# EAGLE design Wireless_IMU_v1.0 (EAGLE 9.6.2)
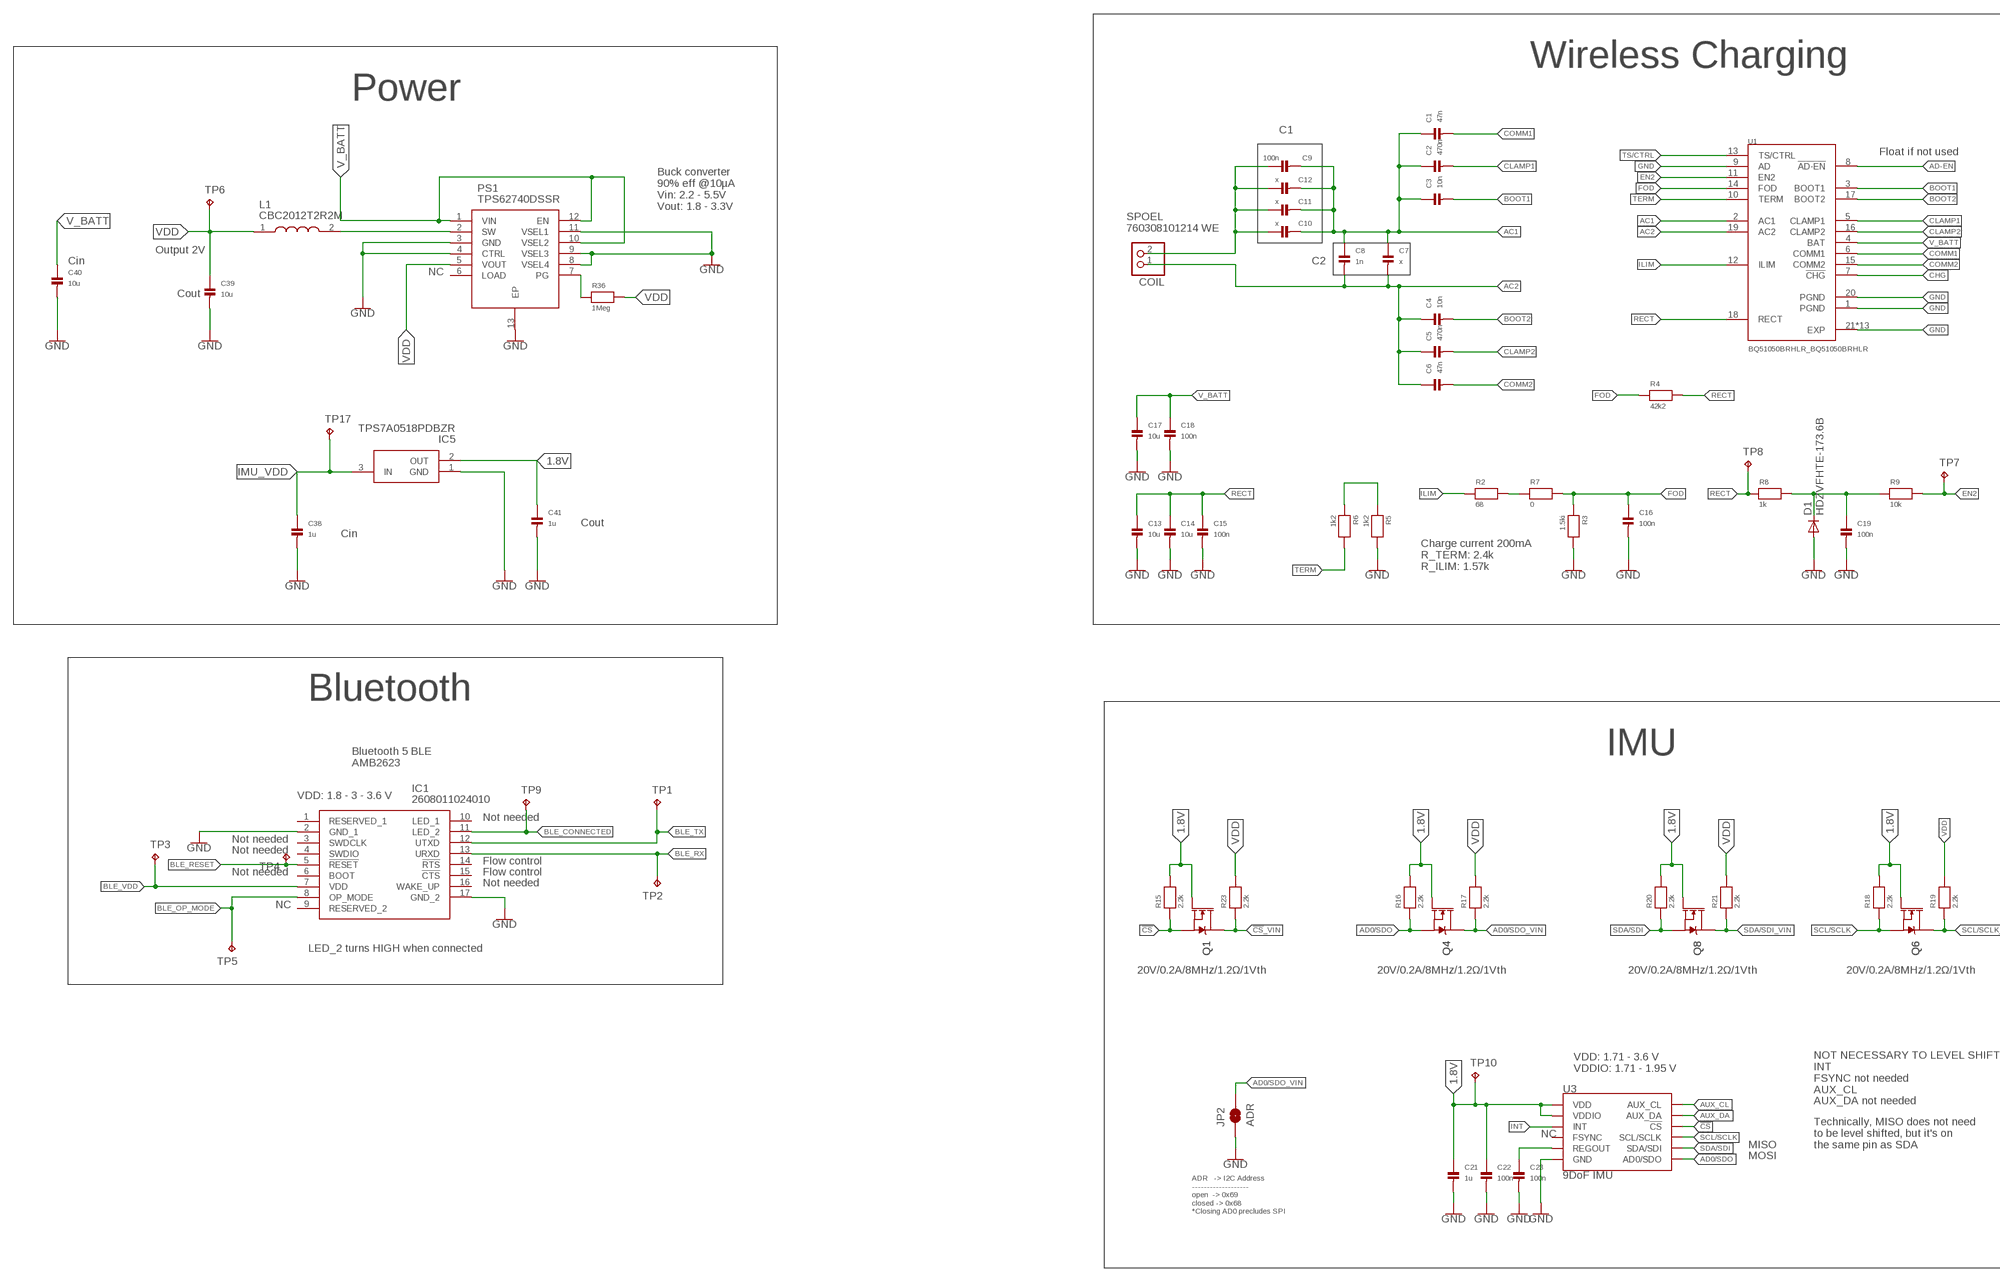
[diagram p0: schematic, sheet 1, part 1 of 2]
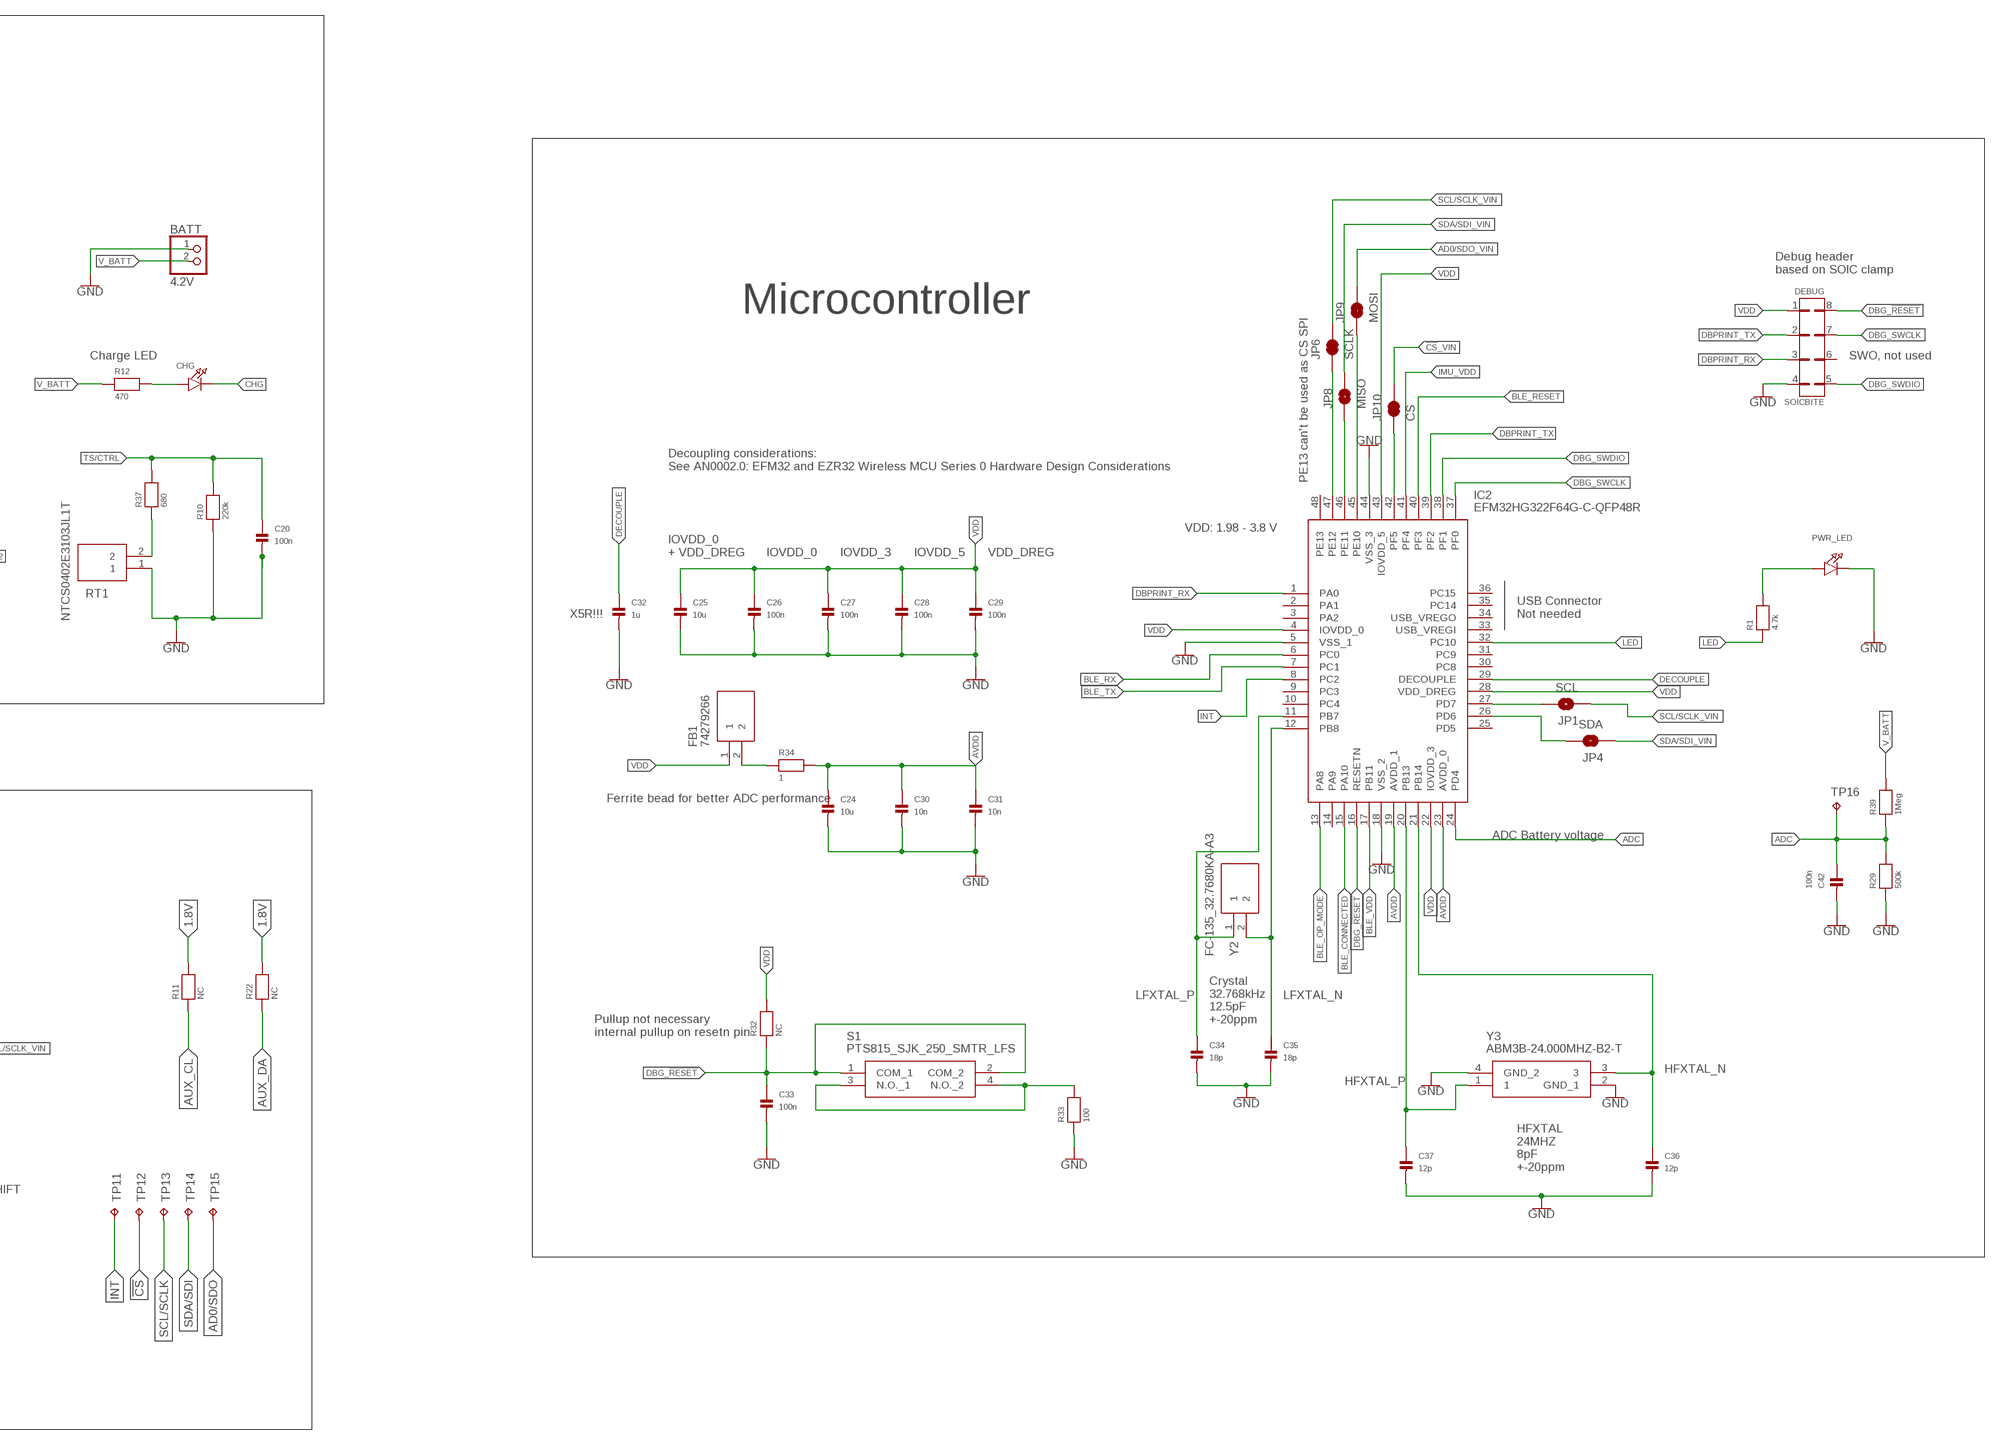
[diagram p1: schematic, sheet 1, part 2 of 2]

## Parts
BATT  4.2V  PINHD-1X2  [1X02]
C1  47n  CAP_CERAMIC0603  [0603]
C2  470n  CAP_CERAMIC0603  [0603]
C3  10n  CAP_CERAMIC0603  [0603]
C4  10n  CAP_CERAMIC0603  [0603]
C5  470n  CAP_CERAMIC0603  [0603]
C6  47n  CAP_CERAMIC0603  [0603]
C7  x  CAP_CERAMIC0603  [0603]
C8  1n  CAP_CERAMIC0603  [0603]
C9  100n  CAP_CERAMIC0603  [0603]
C10  x  CAP_CERAMIC0603  [0603]
C11  x  CAP_CERAMIC0603  [0603]
C12  x  CAP_CERAMIC0603  [0603]
C13  10u  CAP_CERAMIC0603  [0603]
C14  10u  CAP_CERAMIC0603  [0603]
C15  100n  CAP_CERAMIC0603  [0603]
C16  100n  CAP_CERAMIC0603  [0603]
C17  10u  CAP_CERAMIC0603  [0603]
C18  100n  CAP_CERAMIC0603  [0603]
C19  100n  CAP_CERAMIC0603  [0603]
C20  100n  CAP_CERAMIC0603  [0603]
C21  1u  CAP_CERAMIC0603  [0603]
C22  100n  CAP_CERAMIC0603  [0603]
C23  100n  CAP_CERAMIC0603  [0603]
C24  10u  CAP_CERAMIC0603  [0603]
C25  10u  CAP_CERAMIC0603  [0603]
C26  100n  CAP_CERAMIC0603  [0603]
C27  100n  CAP_CERAMIC0603  [0603]
C28  100n  CAP_CERAMIC0603  [0603]
C29  100n  CAP_CERAMIC0603  [0603]
C30  10n  CAP_CERAMIC0603  [0603]
C31  10n  CAP_CERAMIC0603  [0603]
C32  1u  CAP_CERAMIC0603  [0603]
C33  100n  CAP_CERAMIC0603  [0603]
C34  18p  CAP_CERAMIC0603  [0603]
C35  18p  CAP_CERAMIC0603  [0603]
C36  12p  CAP_CERAMIC0603  [0603]
C37  12p  CAP_CERAMIC0603  [0603]
C38  1u  CAP_CERAMIC0603  [0603]
C39  10u  CAP_CERAMIC0603  [0603]
C40  10u  CAP_CERAMIC0603  [0603]
C41  1u  CAP_CERAMIC0603  [0603]
C42  100n  CAP_CERAMIC0603  [0603]
CHG  LED0805  [CHIPLED_0805]
COIL  PINHD-1X2  [1X02]
D1  HDZVFHTE-173.6B  DIODE-SOD323-W  [SOD323-W]
DEBUG  SOICBITE  [SOICBITE]
FB1  74279266  [BEADC1608X100N]
IC1  2608011024010  [2608011024010]
IC2  EFM32HG322F64G-C-QFP48R  [QFP50P900X900X120-48N]
IC5  TPS7A0518PDBZR  [SOT95P237X112-3N]
JP1  SCL  JUMPER-SMT_2_NO_SILK  [SMT-JUMPER_2_NO_SILK]
JP2  ADR  JUMPER-SMT_2_NO_SILK  [SMT-JUMPER_2_NO_SILK]
JP4  SDA  JUMPER-SMT_2_NO_SILK  [SMT-JUMPER_2_NO_SILK]
JP6  SCLK  JUMPER-SMT_2_NC_TRACE_SILK  [SMT-JUMPER_2_NC_TRACE_SILK]
JP8  MISO  JUMPER-SMT_2_NC_TRACE_SILK  [SMT-JUMPER_2_NC_TRACE_SILK]
JP9  MOSI  JUMPER-SMT_2_NC_TRACE_SILK  [SMT-JUMPER_2_NC_TRACE_SILK]
JP10  CS  JUMPER-SMT_2_NC_TRACE_SILK  [SMT-JUMPER_2_NC_TRACE_SILK]
L1  CBC2012T2R2M  [INDC2012X145N]
PS1  TPS62740DSSR  [SON50P200X300X80-13N]
PWR_LED  LED0805  [CHIPLED_0805]
Q1  20V/0.2A/8MHz/1.2Ω/1Vth  MOSFET-NCH-RE1C002UN  [SOT-416FL]
Q4  20V/0.2A/8MHz/1.2Ω/1Vth  MOSFET-NCH-RE1C002UN  [SOT-416FL]
Q6  20V/0.2A/8MHz/1.2Ω/1Vth  MOSFET-NCH-RE1C002UN  [SOT-416FL]
Q8  20V/0.2A/8MHz/1.2Ω/1Vth  MOSFET-NCH-RE1C002UN  [SOT-416FL]
R1  4.7k  RESISTOR0603  [0603]
R2  68  RESISTOR0603  [0603]
R3  1.5ki  RESISTOR0603  [0603]
R4  42k2  RESISTOR0603  [0603]
R5  1k2  RESISTOR0603  [0603]
R6  1k2  RESISTOR0603  [0603]
R7  0  RESISTOR0603  [0603]
R8  1k  RESISTOR0603  [0603]
R9  10k  RESISTOR0603  [0603]
R10  220k  RESISTOR0603  [0603]
R11  NC  RESISTOR0603  [0603]
R12  470  RESISTOR0603  [0603]
R15  2.2k  RESISTOR0603  [0603]
R16  2.2k  RESISTOR0603  [0603]
R17  2.2k  RESISTOR0603  [0603]
R18  2.2k  RESISTOR0603  [0603]
R19  2.2k  RESISTOR0603  [0603]
R20  2.2k  RESISTOR0603  [0603]
R21  2.2k  RESISTOR0603  [0603]
R22  NC  RESISTOR0603  [0603]
R23  2.2k  RESISTOR0603  [0603]
R29  500k  RESISTOR0603  [0603]
R32  NC  RESISTOR0603  [0603]
R33  100  RESISTOR0603  [0603]
R34  1  RESISTOR0603  [0603]
R36  1Meg  RESISTOR0603  [0603]
R37  680  RESISTOR0603  [0603]
R39  1Meg  RESISTOR0603  [0603]
RT1  NTCS0402E3103JL1T  [CAPC1005X65N]
S1  PTS815_SJK_250_SMTR_LFS  [PTS815SJK250SMTRLFS]
TP1  TPTP10R  [TP10R]
TP2  TPTP10R  [TP10R]
TP3  TPTP10R  [TP10R]
TP4  TPTP10R  [TP10R]
TP5  TPTP10R  [TP10R]
TP6  TPTP10R  [TP10R]
TP7  TPTP10R  [TP10R]
TP8  TPTP10R  [TP10R]
TP9  TPTP10R  [TP10R]
TP10  TPTP10R  [TP10R]
TP11  TPTP10R  [TP10R]
TP12  TPTP10R  [TP10R]
TP13  TPTP10R  [TP10R]
TP14  TPTP10R  [TP10R]
TP15  TPTP10R  [TP10R]
TP16  TPTP10R  [TP10R]
TP17  TPTP10R  [TP10R]
U1  BQ51050BRHLR_BQ51050BRHLR  [BQ51050BRHLR_QFN50P450X350X100-21N]
U3  9DoF IMU  SPARKFUN-SENSORS_ICM-20948  [SPARKFUN-SENSORS_QFN24-3X3]
Y2  FC-135_32.7680KA-A3  [FC135327680KAAG0]
Y3  ABM3B-24.000MHZ-B2-T  [ABM3B8000MHZ101UT]

## Nets
1.8V: C21.1 C22.1 C41.1 IC5.2(OUT) Q1.1(G) Q4.1(G) Q6.1(G) Q8.1(G) R11.2 R15.2 R16.2 R18.2 R20.2 R22.2 TP10.TP U3.8(VDDIO) U3.13(VDD)
!CS: Q1.2(S) R15.1 TP12.TP U3.22(!CS)
!CS!_VIN: JP10.2 Q1.3(D) R23.1
AC1: C1.1 C2.1 C3.1 C7.1 C8.1 C9.2 C10.2 C11.2 C12.2 U1.2(AC1)
AC2: C4.1 C5.1 C6.1 C7.2 C8.2 COIL.1 U1.19(AC2)
AC11: C9.1 C10.1 C11.1 C12.1 COIL.2
AD0/SDO: Q4.2(S) R16.1 TP15.TP U3.9(AD0/SDO)
AD0/SDO_VIN: JP2.2 JP9.2 Q4.3(D) R17.1
AD-EN: U1.8(!AD-EN)
ADC: C42.1 IC2.24(PD4) R29.2 R39.1 TP16.TP
AUX_CL: R11.1 U3.7(AUX_CL)
AUX_DA: R22.1 U3.21(AUX_DA)
AVDD: C24.1 C30.1 C31.1 IC2.19(AVDD_1) IC2.23(AVDD_0) R34.2
BLE_CONNECTED: IC1.11(LED_2) IC2.15(PA10) TP9.TP
BLE_OP_MODE: IC1.8(OP_MODE) IC2.13(PA8) TP5.TP
BLE_RESET: IC1.5(!RESET) IC2.40(PF3) TP4.TP
BLE_RX: IC1.13(URXD) IC2.6(PC0) TP2.TP
BLE_TX: IC1.12(UTXD) IC2.7(PC1) TP1.TP
BLE_VDD: IC1.7(VDD) IC2.17(PB11) TP3.TP
BOOT1: C3.2 U1.3(BOOT1)
BOOT2: C4.2 U1.17(BOOT2)
CHG: CHG.C U1.7(!CHG)
CLAMP1: C2.2 U1.5(CLAMP1)
CLAMP2: C5.2 U1.16(CLAMP2)
COMM1: C1.2 U1.6(COMM1)
COMM2: C6.2 U1.15(COMM2)
DBG_!RESET: C33.1 DEBUG.8 IC2.16(RESETN) R32.1 S1.1(COM_1) S1.2(COM_2)
DBG_SWCLK: DEBUG.7 IC2.37(PF0)
DBG_SWDIO: DEBUG.5 IC2.38(PF1)
DBPRINT_RX: DEBUG.3 IC2.1(PA0)
DBPRINT_TX: DEBUG.2 IC2.39(PF2)
DECOUPLE: C32.1 IC2.29(DECOUPLE)
EN2: R9.2 TP7.TP U1.11(EN2)
FOD: C16.1 R3.1 R4.1 R7.2 U1.14(FOD)
GND: BATT.1 C13.2 C14.2 C15.2 C16.2 C17.2 C18.2 C19.2 C20.2 C21.2 C22.2 C23.2 C24.2 C25.2 C26.2 C27.2 C28.2 C29.2 C30.2 C31.2 C32.2 C33.2 C34.2 C35.2 C36.2 C37.2 C38.2 C39.2 C40.2 C41.2 C42.2 D1.A DEBUG.4 IC1.2(GND_1) IC1.17(GND_2) IC2.5(VSS_1) IC2.18(VSS_2) IC2.44(VSS_3) IC5.1(GND) JP2.1 PS1.3(GND) PS1.4(CTRL) PS1.8(VSEL4) PS1.9(VSEL3) PS1.11(VSEL1) PS1.13(EP) PWR_LED.C R3.2 R5.2 R10.1 R29.1 R33.1 RT1.1 U1.1(PGND) U1.9(AD) U1.20(PGND) U1.21(EXP) U1.22(EXP) U1.23(EXP) U1.24(EXP) U1.25(EXP) U1.26(EXP) U1.27(EXP) U1.28(EXP) U1.29(EXP) U1.30(EXP) U1.31(EXP) U1.32(EXP) U1.33(EXP) U3.18(GND) U3.20(GND) Y3.2(GND_1) Y3.4(GND_2)
ILIM: R2.1 U1.12(ILIM)
IMU_VDD: C38.1 IC2.41(PF4) IC5.3(IN) TP17.TP
INT: IC2.8(PC2) TP11.TP U3.12(INT)
LED: IC2.32(PC10) R1.1
N$1: IC2.27(PD7) JP1.2
N$2: R5.1 R6.1
N$3: PWR_LED.A R1.2
N$4: R2.2 R7.1
N$5: CHG.A R12.2
N$6: C19.1 D1.C R8.2 R9.1
N$7: IC2.26(PD6) JP4.2
N$8: IC2.47(PE12) JP6.1
N$9: C35.1 IC2.12(PB8) Y2.2
N$10: C23.1 U3.10(REGOUT)
N$11: IC2.46(PE11) JP8.1
N$12: IC2.45(PE10) JP9.1
N$14: C34.1 IC2.11(PB7) Y2.1
N$15: IC2.42(PF5) JP10.1
N$19: C37.1 IC2.20(PB13) Y3.1
N$20: C36.1 IC2.21(PB14) Y3.3
N$22: R33.2 S1.3(N.O._1) S1.4(N.O._2)
N$24: FB1.2 R34.1
N$25: R37.1 RT1.2
N$28: L1.2 PS1.2(SW)
N$29: PS1.7(PG) R36.1
RECT: C13.1 C14.1 C15.1 R4.2 R8.1 TP8.TP U1.18(RECT)
SCL/SCLK: Q6.2(S) R18.1 TP13.TP U3.23(SCL/SCLK)
SCL/SCLK_VIN: JP1.1 JP6.2 Q6.3(D) R19.1
SDA/SDI: Q8.2(S) R20.1 TP14.TP U3.24(SDA/SDI)
SDA/SDI_VIN: JP4.1 JP8.2 Q8.3(D) R21.1
TERM: R6.2 U1.10(TERM)
TS/CTRL: C20.1 R10.2 R37.2 U1.13(TS/CTRL)
V_BATT: BATT.2 C17.1 C18.1 C40.1 PS1.1(VIN) PS1.10(VSEL2) PS1.12(EN) R12.1 R39.2 U1.4(BAT)
VDD: C25.1 C26.1 C27.1 C28.1 C29.1 C39.1 DEBUG.1 FB1.1 IC2.4(IOVDD_0) IC2.22(IOVDD_3) IC2.28(VDD_DREG) IC2.43(IOVDD_5) L1.1 PS1.5(VOUT) R17.2 R19.2 R21.2 R23.2 R32.2 R36.2 TP6.TP
Unconnected: DEBUG.6 IC1.1(RESERVED_1) IC1.3(SWDCLK) IC1.4(SWDIO) IC1.6(BOOT) IC1.9(RESERVED_2) IC1.10(LED_1) IC1.14(!RTS) IC1.15(!CTS) IC1.16(WAKE_UP) IC2.2(PA1) IC2.3(PA2) IC2.9(PC3) IC2.10(PC4) IC2.14(PA9) IC2.25(PD5) IC2.30(PC8) IC2.31(PC9) IC2.33(USB_VREGI) IC2.34(USB_VREGO) IC2.35(PC14) IC2.36(PC15) IC2.48(PE13) PS1.6(LOAD) U3.11(FSYNC)

## Notes on the sheet
- Wireless Charging
- Power
- C1
- Float if not used
- Buck converter
  90% eff @10µA
  Vin: 2.2 - 5.5V
  Vout: 1.8 - 3.3V
- SPOEL
  760308101214 WE
- Debug header
  based on SOIC clamp
- Output 2V
- Cin | C2
- NC
- Microcontroller
- Cout
- Charge LED | SWO, not used
- Decoupling considerations:
  See AN0002.0: EFM32 and EZR32 Wireless MCU Series 0 Hardware Design Considerations
- PE13 can't be used as CS SPI
- VDD: 1.98 - 3.8 V
- IOVDD_0
  + VDD_DREG
- IOVDD_0 | IOVDD_3 | IOVDD_5 | VDD_DREG
- Cout
- Cin
- X5R!!!
- USB Connector
  Not needed
- Charge current 200mA
  R_TERM: 2.4k
  R_ILIM: 1.57k
- Bluetooth
- Ferrite bead for better ADC performance
- ADC Battery voltage
- IMU
- Bluetooth 5 BLE
  AMB2623
- VDD: 1.8 - 3 - 3.6 V
- Not needed
- Not needed
- Not needed
- Flow control
- Not needed | Flow control
- Not needed | LFXTAL_P | LFXTAL_N
- NC
- Crystal
  32.768kHz
  12.5pF
  +-20ppm
- Pullup not necessary
  internal pullup on resetn pin
- LED_2 turns HIGH when connected | HFXTAL_N
- HFXTAL_P
- HFXTAL
  24MHZ
  8pF
  +-20ppm
- VDD: 1.71 - 3.6 V
  VDDIO: 1.71 - 1.95 V
- NOT NECESSARY TO LEVEL SHIFT
  INT
  FSYNC not needed
  AUX_CL
  AUX_DA not needed
- NC
- MISO
- Technically, MISO does not need 
  to be level shifted, but it's on 
  the same pin as SDA
- MOSI
- ADR   -> I2C Address
  -------------------
  open  -> 0x69
  closed -> 0x68
  *Closing AD0 precludes SPI

## Library data of the parts
BATT COIL = pinhead:PINHD-1X2: PIN HEADER
C1-C42 = microbuilder:CAP_CERAMIC: Ceramic Capacitors 0402 - 0402 Surface Mount Capacitors 16pF 50V 5% [Digikey: 445-4899-2-ND] 18pF 50V 5% [Digikey: 490-1281-2-ND] 22pF 50V 5% [Digikey: 490-1283-2-ND] 68pF 50V 5% [Digikey: 490-1289-2-ND] 0.1uF 10V 10% [Digikey: 490-1318-2-ND] 1.0uF 6.3V 10% [Digikey: 490-1320-2-ND] 0603 - 0603 Surface Mount Capacitors 16 pF 50V 5% [Digikey: 445-5051-2-ND] 22 pF 50V [Digikey: PCC220ACVTR-ND] 33 pF 50V 5% [Digikey: 490-1415-1-ND] 56pF 50V 5% [Digikey: 490-1421-1-ND] 220pF 50V 5% [Digikey: 445-1285-1-ND] 680 pF 50V 2200 pF 50V 5% C0G [Digikey: 445-1297-1-ND] 5600 pF 100V 5% X7R [Digikey: 478-3711-1-ND] 0.1 µF 25V 10% [Digikey: PCC2277TR-ND] 0.22 µF 16V 10% X7R [Digikey: 445-1318-1-ND] 1.0 µF 25V 10% [Digikey: 445-5146-2-ND] 0603 - RF Specific 3pF 250V +/-0.1pF RF [Digikey: 712-1347-1-ND] 18 pF 250V 5% [Digikey: 478-3505-1-ND or 712-1322-1-ND] 56 pF 250V 5% C0G RF [Digikey: 490-4867-1-ND] 68 pF 250V RF [Digikey: 490-4868-1-ND] 0805 - 0805 Surface Mount Capacitors 220 pF 250V 2% RF Ceramic Capacitor [Digikey: 712-1398-1-ND] 1000 pF 50V 2% NP0 Ceramic Capacitor [Digikey: 478-3760-1-ND] 0.1 µF 25V 10% Ceramic Capacitor [Digikey: PCC1828TR-ND] 1.0 µF 16V 10% Ceramic Capacitor[Digikey: 490-1691-2-ND] 10.0 µF 10V 10% Ceramic Capacitor[Digikey: 709-1228-1-ND] 10.0 uF 16V 10% Ceramic Capacitor [Digikey: 478-5165-2-ND] 47 uF 6.3V 20% Ceramic Capacitor [Digikey: 587-1779-1-ND or 399-5506-1-ND] 1206 - 1206 Surface Mount Capacitors 47uF 10V 20% Ceramic Capacitor [Digikey: 490-5528-1-ND or 399-5508-1-ND or 445-6010-1-ND] 100uF 6.3V -20%, +80% Y5V Ceramic Capacitor (Digikey: 490-4512-1-ND, Mouser: 81-GRM31CF50J107ZE1L)
CHG PWR_LED = microbuilder:LED: LED 0603 - 0603 Surface Mount Package 2mA: Green LED - Low Power (3.9mcd, 2ma, 1.7Vf) - Digikey: 475-2709-2-ND Orange LED - Low Power (9.8mcd, 2ma, 1.8Vf) - Digikey: 475-1194-2-ND Red LED - Low Power (5mcd, 2ma, 1.8Vf) - Digikey: 475-1195-2-ND Yellow LED - Low Power (7mcd, 2ma, 1.8Vf) - Digikey: 475-1196-2-ND 5mA: Blue LED - Low Power (17mcd, 5ma, 2.9Vf) - Digikey: LNJ937W8CRACT-ND 0805 - 0805 Surface Mount Package 2mA: Red LED (8.8mcd, 2mA, 1.8Vf, Clear) - Low Power [Digikey: 475-2510-1-ND] Green LED (5mcd, 2mA, 1.8Vf, Clear) - Low Power [Digikey: 475-2730-1-ND] Yellow LED (11.3mcd, 2mA, 1.8Vf, Clear) - Low Power [Digikey: 475-2555-1-ND] 20mA: Red LED (104mcd, 20mA, Diffused) - LS R976 [Digikey: 475-1278-6-ND] Red LED (12mcd, 20mA, 2.0Vf, Clear) - APT2012EC [Digikey: 754-1128-1-ND] Green LED (15mcd, 20mA, 2.2Vf, Clear) - APT2012GC [Digikey: 754-1131-1-ND] Orange LED (160mcd, 20mA, 2.1Vf, Clear) - APT2012SECK [Digikey: 754-1130-1-ND] 1206 - 1206 Surface Mount Package Green LED (26mcd, 20mA, Diffused) - LG N971 [Digikey: 475-1407-6-ND] Red LED (15mcd, 20mA, Diffused) - LH N974 [Digikey: 475-1416-6-ND]
D1 = diode:DIODE-: DIODE
DEBUG = SOICbite_Eagle:SOICBITE: SOICbite footprint Allows for direct clipping of a SOIC-8 Testclip onto a PCB edge for Programming/Debugging purposes without extra components. Original footprint created by: Simon Merrit Adapted to Eagle by: Chiel Voswijk (Foxhood) NOTE: Footprint is to be used on the edge of a PCB and may require the use of thin traces for accessing the inner pads. This may violate some Design Rules! One can often ignore these, but understand working is NOT guaranteed.
FB1 = SamacSys_Parts:74279266: WE-CBF Ferrite Bead 0603 1000Ohm 200mA Wurth WE-CBF Series +/-25% Ferrite Multilayer SMD Inductor, 0603 Case, 200mA dc 600m Rdc Source: Datasheet <https://componentsearchengine.com/Datasheets/1/74279266.pdf>; DESCRIPTION: WE-CBF Ferrite Bead 0603 1000Ohm 200mA Wurth WE-CBF Series +/-25% Ferrite Multilayer SMD Inductor, 0603 Case, 200mA dc 600m Rdc; HEIGHT: 1mm; MANUFACTURER_NAME: Wurth Elektronik; MANUFACTURER_PART_NUMBER: 74279266; MOUSER_PART_NUMBER: 710-74279266; MOUSER_PRICE-STOCK: https://www.mouser.com/Search/Refine.aspx?Keyword=710-74279266
IC1 = SamacSys_Parts:2608011024010: Bluetooth Modules (802.15.1) Proteus-II Series BLE5 Source: Datasheet <https://componentsearchengine.com/Datasheets/1/2608011024010.pdf>; DESCRIPTION: Bluetooth Modules (802.15.1) Proteus-II Series BLE5; HEIGHT: 2.2mm; MANUFACTURER_NAME: Wurth Elektronik; MANUFACTURER_PART_NUMBER: 2608011024010; MOUSER_PART_NUMBER: 710-2608011024010; MOUSER_PRICE-STOCK: https://www.mouser.com/Search/Refine.aspx?Keyword=710-2608011024010
IC2 = SamacSys_Parts:EFM32HG322F64G-C-QFP48R: ARM Microcontrollers - MCU ARM Cortex -M0+ Happy Gecko Microcontroller IC 32-Bit 25MHz 64KB Flash QFN48 (7x7) Source: Datasheet <https://componentsearchengine.com/Datasheets/1/EFM32HG322F64G-C-QFP48R.pdf>; DESCRIPTION: ARM Microcontrollers - MCU ARM Cortex -M0+ Happy Gecko Microcontroller IC 32-Bit 25MHz 64KB Flash QFN48 (7x7); HEIGHT: 1.2mm; MANUFACTURER_NAME: Silicon Labs; MANUFACTURER_PART_NUMBER: EFM32HG322F64G-C-QFP48R; MOUSER_PART_NUMBER: 634-HG322F64GCQFP48R; MOUSER_PRICE-STOCK: https://www.mouser.com/Search/Refine.aspx?Keyword=634-HG322F64GCQFP48R
IC5 = SamacSys_Parts:TPS7A0518PDBZR: 1-A, ultra-low-IQ, 200-mA low-dropout (LDO) regulator in a small-sized package Source: Datasheet <https://www.ti.com/lit/gpn/TPS7A05>; DESCRIPTION: 1-A, ultra-low-IQ, 200-mA low-dropout (LDO) regulator in a small-sized package; HEIGHT: 1.12mm; MANUFACTURER_NAME: Texas Instruments; MANUFACTURER_PART_NUMBER: TPS7A0518PDBZR; MOUSER_PART_NUMBER: 595-TPS7A0518PDBZR; MOUSER_PRICE-STOCK: https://www.mouser.com/Search/Refine.aspx?Keyword=595-TPS7A0518PDBZR
JP1 JP2 JP4 = SparkFun-Jumpers:JUMPER-SMT_2_NO: Normally open jumper This jumper has two pads in close proximity to each other. Apply solder to close the connection. Round pads are easier to solder for beginners, but are a lot larger. SparkFun Product that uses the round pads: SparkFun EL Sequencer <https://www.sparkfun.com/products/12781>
JP6 JP8-JP10 = SparkFun-Jumpers:JUMPER-SMT_2_NC_TRACE: Normally closed trace jumper This jumper has a trace between two pads so it's normally closed (NC). Use a razor knife to open the connection. For best results follow the IPC guidelines for cutting traces: Cutout at least 0.063 mm (0.005 in). Remove all loose material to clean up the cut area. Seal the cut with an approved epoxy. Reapply solder to reclose the connection.
L1 = SamacSys_Parts:CBC2012T2R2M: Taiyo Yuden Type 0805 Wire-wound SMD Inductor 2.2 H +/-20% Wire-Wound 640mA Idc Source: Datasheet <https://componentsearchengine.com/Datasheets/1/CBC2012T2R2M.pdf>; DESCRIPTION: Taiyo Yuden Type 0805 Wire-wound SMD Inductor 2.2 H +/-20% Wire-Wound 640mA Idc; HEIGHT: 1.45mm; MANUFACTURER_NAME: TAIYO YUDEN; MANUFACTURER_PART_NUMBER: CBC2012T2R2M; MOUSER_PART_NUMBER: 963-CBC2012T2R2M; MOUSER_PRICE-STOCK: https://www.mouser.com/Search/Refine.aspx?Keyword=963-CBC2012T2R2M
PS1 = SamacSys_Parts:TPS62740DSSR: 2.2V-5.5V input, ultra-low-power 300mA step-down buck DCDC converter with 360nA Iq Source: Datasheet <http://www.ti.com/lit/gpn/tps62740>; DESCRIPTION: 2.2V-5.5V input, ultra-low-power 300mA step-down buck DCDC converter with 360nA Iq; HEIGHT: 0.8mm; MANUFACTURER_NAME: Texas Instruments; MANUFACTURER_PART_NUMBER: TPS62740DSSR; MOUSER_PART_NUMBER: 595-TPS62740DSSR; MOUSER_PRICE-STOCK: https://www.mouser.com/Search/Refine.aspx?Keyword=595-TPS62740DSSR
Q1 Q4 Q6 Q8 = SparkFun-DiscreteSemi:MOSFET-NCH: N-channel MOSFETs Voltage controlled devices that allow control of high current outputs. SparkFun Products: SparkFun OpenScale <https://www.sparkfun.com/products/13261> SparkFun Digital Sandbox <https://www.sparkfun.com/products/12651> SparkFun Monster Moto Shield <https://www.sparkfun.com/products/10182> SparkFun MOSFET Power Controller <https://www.sparkfun.com/products/11214>; PROD_ID: TRANS_14399
R1-R12 R15-R23 R29 R32-R34 R36 R37 R39 = microbuilder:RESISTOR: Resistors 0402 - 0402 Surface Mount Package 22 Ohm 1% 1/16W [Digikey: 311-22.0LRTR-ND] 33 Ohm 5% 1/16W 1.0K 5% 1/16W 1.5K 5% 1/16W 2.0K 1% 1/16W 10.0K 1% 1/16W [Digikey: 311-10.0KLRTR-ND] 10.0K 5% 1/16W [Digikey: RMCF0402JT10K0TR-ND] 12.1K 1% 1/16W [Digikey: 311-22.0LRTR-ND] 100.0K 5% 1/16W 0603 - 0603 Surface Mount Package 0 Ohm 1/10 Watt 1% Resistor 15 Ohm 1/10 Watt 1% Resistor 33 Ohm 1/10 Watt 1% Resistor 49.9 Ohm 1/10 Watt 1% Resistor 100 Ohm 1/10 Watt 1% Resistor 150 Ohm 1/10 Watt 1% Resistor 240 Ohm 1/10 Watt 1% Resistor 390 Ohm 1/10 Watt 1% Resistor 560 Ohm 1/10 Watt 1% Resistor 680 Ohm 1/10 Watt 1% Resistor 750 Ohm 1/10 Watt 1% Resistor 1.0K Ohm 1/10 Watt 1% Resistor 1.5K Ohm 1/10 Watt 1% Resistor 2.0K Ohm 1/10 Watt 1% Resistor 2.2K Ohm 1/10 Watt 1% Resistor 3.3K Ohm 1/10 Watt 1% Resistor 4.7K Ohm 1/10 Watt 1% Resistor 10.0K Ohm 1/10 Watt 1% Resistor 12.0K Ohm 1/10 Watt 1% Resistor 12.1K Ohm 1/10 Watt 1% Resistor 20.0K Ohm 1/10 Watt 1% Resistor 33.0K Ohm 1/10 Watt 1% Resistor 100.0K Ohm 1/10 Watt 1% Resistor 0805 - 0805 Surface Mount Package 0 Ohm 1/8 Watt 1% Resistor 33 Ohm 1/8 Watt 1% Resistor 100 Ohm 1/8 Watt 1% Resistor 150 Ohm 1/8 Watt 1% Resistor 200 Ohm 1/8 Watt 1% Resistor 240 Ohm 1/8 Watt 1% Resistor 330 Ohm 1/8 Watt 1% Resistor 390 Ohm 1/8 Watt 1% Resistor 470 Ohm 1/8 Watt 1% Resistor 1.0K Ohm 1/8 Watt 1% Resistor 1.5K Ohm 1/8 Watt 1% Resistor 2.0K Ohm 1/8 Watt 1% Resistor 4.7K Ohm 1/8 Watt 1% Resistor 5.1K Ohm 1/8 Watt 1% Resistor 5.6K Ohm 1/8 Watt 1% Resistor 10.0K Ohm 1/8 Watt 1% Resistor 22.0K Ohm 1/8 Watt 1% Resistor 33.0K Ohm 1/8 Watt 1% Resistor 100K Ohm 1/8 Watt 1% Resistor 1206 - 1206 Surface Mount Package 2012 - 2010 Surface Mount Package 0.11 Ohm 1/2 Watt 1% Resistor - Digikey: RHM.11UCT-ND
RT1 = SamacSys_Parts:NTCS0402E3103JL1T: NTC Thermistors 10K 5% 3490K Low B AUTO GRADE Source: Datasheet <https://componentsearchengine.com/Datasheets/1/NTCS0402E3103JL1T.pdf>; DESCRIPTION: NTC Thermistors 10K 5% 3490K Low B AUTO GRADE; HEIGHT: 0.65mm; MANUFACTURER_NAME: Vishay; MANUFACTURER_PART_NUMBER: NTCS0402E3103JL1T; MOUSER_PART_NUMBER: 594-NTCS402E3103JL1T; MOUSER_PRICE-STOCK: https://www.mouser.com/Search/Refine.aspx?Keyword=594-NTCS402E3103JL1T
S1 = SamacSys_Parts:PTS815_SJK_250_SMTR_LFS: Tactile Switches Tact Switch, 12 VDC, 50 mA, 4.2x3.2, 2.5mm H, 250gf, J leads Source: Datasheet <https://componentsearchengine.com/Datasheets/1/PTS815 SJK 250 SMTR LFS.pdf>; DESCRIPTION: Tactile Switches Tact Switch, 12 VDC, 50 mA, 4.2x3.2, 2.5mm H, 250gf, J leads; HEIGHT: 2mm; MANUFACTURER_NAME: C & K COMPONENTS; MANUFACTURER_PART_NUMBER: PTS815 SJK 250 SMTR LFS; MOUSER_PART_NUMBER: 611-PTS815SJK250SMTR; MOUSER_PRICE-STOCK: https://www.mouser.com/Search/Refine.aspx?Keyword=611-PTS815SJK250SMTR
TP1-TP17 = testpad:TP: Test pad
U1 = Wireless_IMU_v1.0:BQ51050BRHLR_BQ51050BRHLR: Qi (WPC) Compliant Highly Integrated Secondary-Side Direct Lithium Ion Charger. 20-VQFN; AVAILABILITY: Unavailable; DESCRIPTION: Qi _WPC_ Compliant Highly Integrated Secondary-Side Direct Lithium Ion Charger. 20-VQFN; MF: Texas Instruments; MP: BQ51050BRHLR; PACKAGE: VQFN-20 Texas Instruments; PRICE: None
U3 = Wireless_IMU_v1.0:SPARKFUN-SENSORS_ICM-20948: ICM-20948 9 Degree of Freedom IMU World’s lowest power 9-axis MotionTracking device that is ideally suited for smartphones, tablets, wearable sensors, and IoT applications. Includes onboard Digital Motion Processor to offload computations from the host processor Datasheet <https://cdn.sparkfun.com/assets/learn_tutorials/5/5/0/MPU9250REV1.0.pdf> SparkFun Products: SparkFun IMU Breakout - ICM-20948 <https://www.sparkfun.com/products/15182>; PROD_ID: IC-14247
Y2 = SamacSys_Parts:FC-135_32.7680KA-A3: Crystals 32.768KHz 20ppm 12.5pF -40C -85C Source: Datasheet <https://componentsearchengine.com/Datasheets/1/FC-135 32.7680KA-A3.pdf>; DESCRIPTION: Crystals 32.768KHz 20ppm 12.5pF -40C -85C; HEIGHT: 0mm; MANUFACTURER_NAME: Epson Timing; MANUFACTURER_PART_NUMBER: FC-135 32.7680KA-A3; MOUSER_PART_NUMBER: 732-FC135-32.76KAA3; MOUSER_PRICE-STOCK: https://www.mouser.com/Search/Refine.aspx?Keyword=732-FC135-32.76KAA3
Y3 = SamacSys_Parts:ABM3B-24.000MHZ-B2-T: Abracon 24MHz Crystal +/-20ppm SMD 5 x 3 x 1.1mm Source: Datasheet <https://componentsearchengine.com/Datasheets/1/ABM3B-24.000MHZ-B2-T.pdf>; DESCRIPTION: Abracon 24MHz Crystal +/-20ppm SMD 5 x 3 x 1.1mm; HEIGHT: 1.1mm; MANUFACTURER_NAME: ABRACON; MANUFACTURER_PART_NUMBER: ABM3B-24.000MHZ-B2-T; MOUSER_PART_NUMBER: 815-ABM3B-24-B2; MOUSER_PRICE-STOCK: https://www.mouser.com/Search/Refine.aspx?Keyword=815-ABM3B-24-B2

## Board
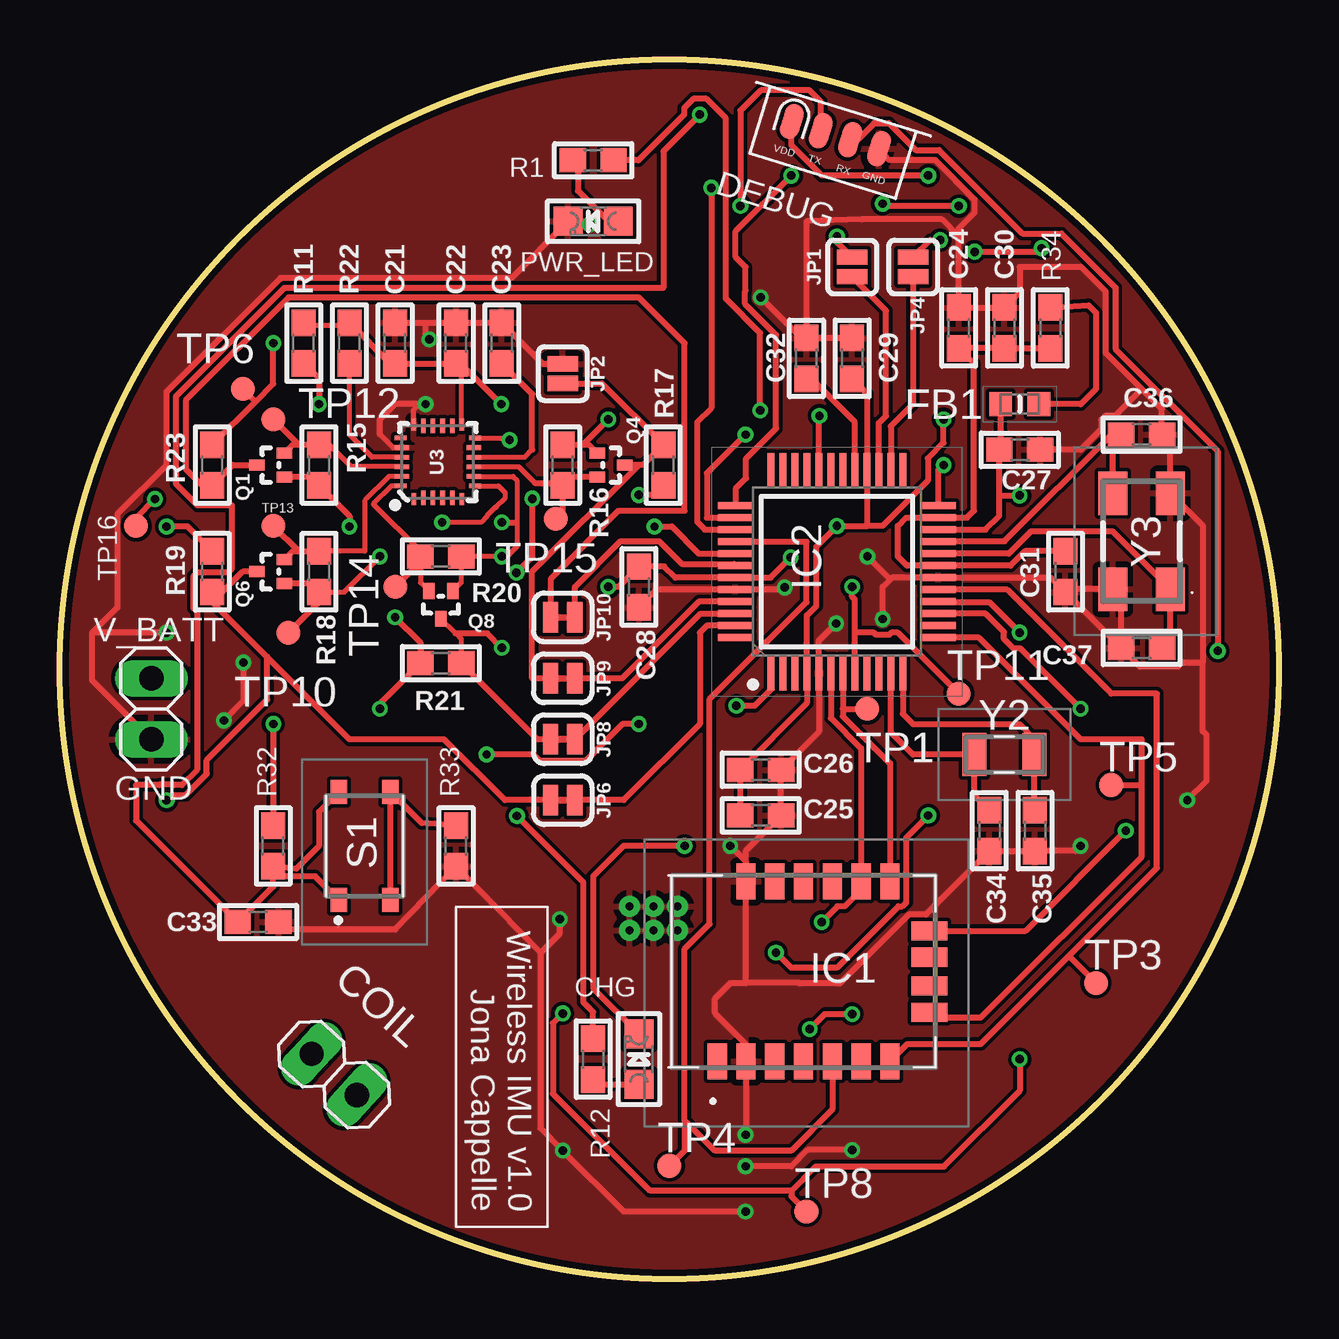
[diagram p2: board, top side]
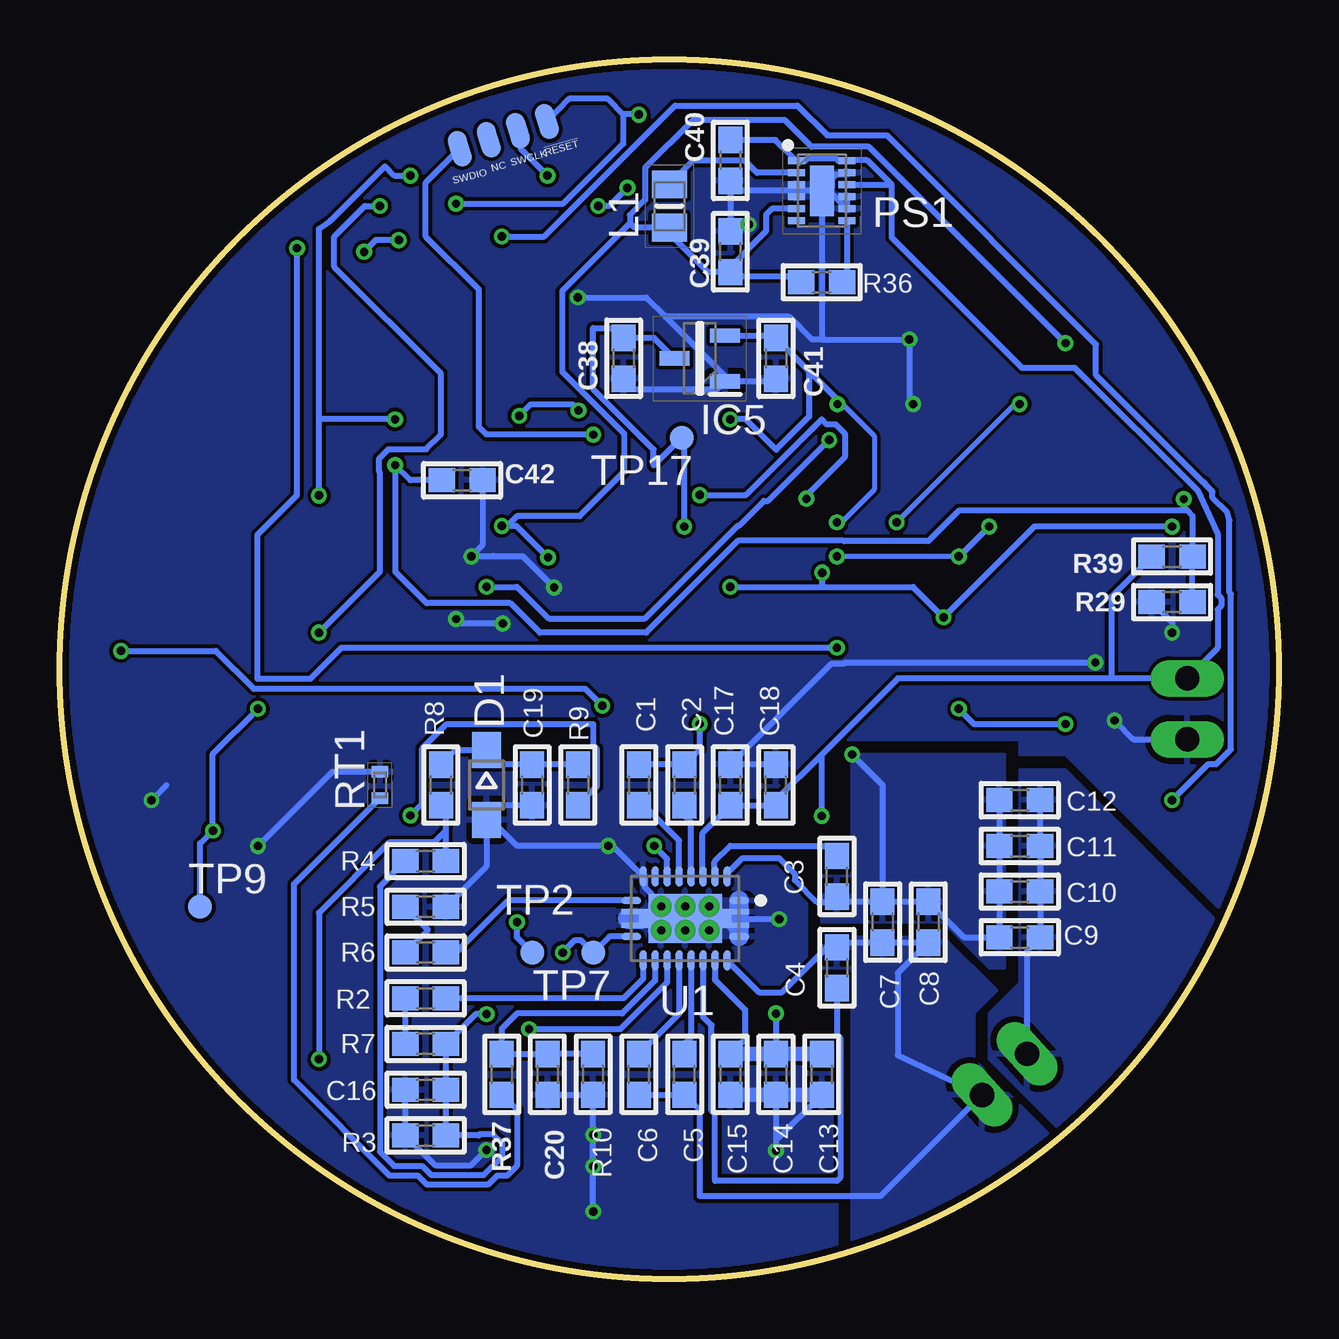
[diagram p3: board, bottom side, seen from below]

Size 50.8 x 50.8 mm. Coordinates in mm from the lower left corner, seen from the top.
Outline: circle at 25.4,25.4 radius 25.4
Copper layers (1*16): Top 0.035mm / dielectric 1.5mm / Bottom 0.035mm
Design rules "SeeedStudio_2layer_DRU_no_angle_20140221-2": minimum track width 6mil, minimum drill 12mil, track to track 6mil, track to pad 6mil, pad to pad 6mil, via to via 6mil, smd to smd 0mil, copper to edge 10mil, drill to drill 10mil, minimum pad ring 10mil, minimum via ring 6mil, stop-mask expansion 2mil, vias tented up to drill 100mil, thermal gap 10mil

### Footprints (pad centres in the part's own frame; a part is rotated, then mirrored left to right if it is on the bottom)
1X02 = drill 1.016 long: 1 -1.27,0; 2 1.27,0
0603 = smd 1.1 x 1: 1 -0.85,0; 2 0.85,0
CHIPLED_0805 = smd 1.2 x 1.2: A 0,-1.05; C 0,1.05
SOD323-W = smd 1.5 x 1.2: A 1.45,0; C -1.45,0
SOICBITE = smd 0.8 x 1.5: 1 1.905,0.75; 2 0.635,0.75; 3 -0.635,0.75; 4 -1.905,0.75 | smd 0.8 x 1.5 bottom: 5 -1.905,0.75; 6 -0.635,0.75; 7 0.635,0.75; 8 1.905,0.75
BEADC1608X100N = smd 0.95 x 1: 1 -0.8,0; 2 0.8,0
2608011024010 = smd 0.8 x 1.5: 1 -3.72,-3.275; 2 -2.52,-3.275; 3 -1.32,-3.275; 4 -0.12,-3.275; 5 1.08,-3.275; 6 2.28,-3.275; 7 3.48,-3.275; 12 3.48,4.225; 13 2.28,4.225; 14 1.08,4.225; 15 -0.12,4.225; 16 -1.32,4.225; 17 -2.52,4.225 | smd 1.5 x 0.8: 8 5.13,-1.225; 9 5.13,-0.125; 10 5.13,1.075; 11 5.13,2.175
QFP50P900X900X120-48N = smd 1.45 x 0.3: 1 -4.225,2.75; 2 -4.225,2.25; 3 -4.225,1.75; 4 -4.225,1.25; 5 -4.225,0.75; 6 -4.225,0.25; 7 -4.225,-0.25; 8 -4.225,-0.75; 9 -4.225,-1.25; 10 -4.225,-1.75; 11 -4.225,-2.25; 12 -4.225,-2.75; 25 4.225,-2.75; 26 4.225,-2.25; 27 4.225,-1.75; 28 4.225,-1.25; 29 4.225,-0.75; 30 4.225,-0.25; 31 4.225,0.25; 32 4.225,0.75; 33 4.225,1.25; 34 4.225,1.75; 35 4.225,2.25; 36 4.225,2.75 | smd 0.3 x 1.45: 13 -2.75,-4.225; 14 -2.25,-4.225; 15 -1.75,-4.225; 16 -1.25,-4.225; 17 -0.75,-4.225; 18 -0.25,-4.225; 19 0.25,-4.225; 20 0.75,-4.225; 21 1.25,-4.225; 22 1.75,-4.225; 23 2.25,-4.225; 24 2.75,-4.225; 37 2.75,4.225; 38 2.25,4.225; 39 1.75,4.225; 40 1.25,4.225; 41 0.75,4.225; 42 0.25,4.225; 43 -0.25,4.225; 44 -0.75,4.225; 45 -1.25,4.225; 46 -1.75,4.225; 47 -2.25,4.225; 48 -2.75,4.225
SOT95P237X112-3N = smd 1.25 x 0.6: 1 -1.05,0.95; 2 -1.05,-0.95; 3 1.05,0
SMT-JUMPER_2_NO_SILK = smd 0.635 x 1.27: 1 -0.406,0; 2 0.406,0
SMT-JUMPER_2_NC_TRACE_SILK = smd 0.635 x 1.27: 1 -0.508,0; 2 0.508,0
INDC2012X145N = smd 1.15 x 1.45: 1 -0.9,0; 2 0.9,0
SON50P200X300X80-13N = smd 0.7 x 0.3: 1 -1.05,1.25; 2 -1.05,0.75; 3 -1.05,0.25; 4 -1.05,-0.25; 5 -1.05,-0.75; 6 -1.05,-1.25; 7 1.05,-1.25; 8 1.05,-0.75; 9 1.05,-0.25; 10 1.05,0.25; 11 1.05,0.75; 12 1.05,1.25 | smd 1 x 2.1: 13 0,0
SOT-416FL = smd 0.46 x 0.65: 1 -0.5,-1.1; 2 0.5,-1.1; 3 0,0.05
CAPC1005X65N = smd 0.48 x 0.68: 1 -0.55,0; 2 0.55,0
PTS815SJK250SMTRLFS = smd 1 x 0.7: 1 -2.25,1.075; 2 2.25,1.075; 3 -2.25,-1.075; 4 2.25,-1.075
TP10R = smd 1 x 1: TP 0,0
BQ51050BRHLR_QFN50P450X350X100-21N = smd 0.85 x 0.3: 1 -2.25,-0.75; 10 2.25,-0.75; 11 2.25,0.75; 20 -2.25,0.75 | smd 0.3 x 0.85: 2 -1.75,-1.75; 3 -1.25,-1.75; 4 -0.75,-1.75; 5 -0.25,-1.75; 6 0.25,-1.75; 7 0.75,-1.75; 8 1.25,-1.75; 9 1.75,-1.75; 12 1.75,1.75; 13 1.25,1.75; 14 0.75,1.75; 15 0.25,1.75; 16 -0.25,1.75; 17 -0.75,1.75; 18 -1.25,1.75; 19 -1.75,1.75 | smd 3.05 x 2.05: 21 0,0 | smd 1.125 x 0.23: 22 2.087,0.275; 24 2.087,-0.275; 25 -2.087,0.275; 27 -2.087,-0.275 | smd 0.4 x 0.7: 23 1.725,0.006; 26 -1.725,0.006 | drill 0.35 pad 0.406: 28 -1,0.5; 29 0,0.5; 30 1,0.5; 31 1,-0.5; 32 0,-0.5; 33 -1,-0.5
SPARKFUN-SENSORS_QFN24-3X3 = smd 0.495 x 0.191: 1 -1.552,1; 6 -1.552,-1; 13 1.552,-1; 18 1.552,1 | smd 0.6 x 0.191: 2 -1.5,0.6; 3 -1.5,0.2; 4 -1.5,-0.2; 5 -1.5,-0.6; 14 1.5,-0.6; 15 1.5,-0.2; 16 1.5,0.2; 17 1.5,0.6 | smd 0.191 x 0.495: 7 -1,-1.552; 12 1,-1.552; 19 1,1.552; 24 -1,1.552 | smd 0.191 x 0.6: 8 -0.6,-1.5; 9 -0.2,-1.5; 10 0.2,-1.5; 11 0.6,-1.5; 20 0.6,1.5; 21 0.2,1.5; 22 -0.2,1.5; 23 -0.6,1.5
FC135327680KAAG0 = smd 1 x 1.8: 1 -1.25,0; 2 1.25,0
ABM3B8000MHZ101UT = smd 1.8 x 1.2: 1 -2,-1.2; 2 2,-1.2; 3 2,1.2; 4 -2,1.2

### Placement (x,y rotation side)
BATT  3.81,23.76 90 top
C1  26.67,20.58 270 bottom
C2  24.76,20.58 270 bottom
C3  18.41,16.77 90 bottom
C4  18.41,12.96 270 bottom
C5  24.76,8.52 90 bottom
C6  26.67,8.52 90 bottom
C7  16.51,14.87 270 bottom
C8  14.6,14.87 270 bottom
C9  10.79,14.23 180 bottom
C10  10.79,16.14 180 bottom
C11  10.79,18.04 180 bottom
C12  10.79,19.95 180 bottom
C13  19.05,8.52 270 bottom
C14  20.95,8.52 270 bottom
C15  22.86,8.52 270 bottom
C16  35.56,7.88 180 bottom
C17  22.86,20.58 90 bottom
C18  20.95,20.58 90 bottom
C19  31.11,20.58 270 bottom
C20  30.48,8.52 270 bottom
C21  13.97,39 90 top
C22  16.51,39 90 top
C23  18.41,39 90 top
C24  37.46,39.63 90 top
C25  29.21,19.31 0 top
C26  29.21,21.22 0 top
C27  40,34.55 0 top
C28  24.13,28.84 270 top
C29  33.02,38.36 90 top
C30  39.37,39.63 90 top
C31  41.91,29.47 270 top
C32  31.11,38.36 90 top
C33  8.25,14.87 0 top
C34  38.73,18.68 270 top
C35  40.64,18.68 270 top
C36  45.08,35.19 0 top
C37  45.08,26.3 180 top
C38  27.3,38.36 270 bottom
C39  22.86,42.81 90 bottom
C40  22.86,46.62 270 bottom
C41  20.95,38.36 270 bottom
C42  34.04,33.28 0 bottom
CHG  24.13,9.15 0 top
COIL  11.43,8.52 137.7 top
D1  33.02,20.58 270 bottom
DEBUG  32.54,48.38 162.8 top
FB1  40,36.46 0 top
IC1  31.11,12.33 0 top
IC2  32.38,29.47 90 top
IC5  24.13,38.36 180 bottom
JP1  33.02,42.17 270 top
JP2  20.95,37.73 270 top
JP4  35.56,42.17 270 top
JP6  20.95,19.95 180 top
JP8  20.95,22.49 180 top
JP9  20.95,25.03 180 top
JP10  20.95,27.57 180 top
L1  25.4,44.71 90 bottom
PS1  19.05,45.35 0 bottom
PWR_LED  22.22,44.08 90 top
Q1  8.25,33.92 90 top
Q4  23.49,33.92 270 top
Q6  8.25,29.47 90 top
Q8  15.87,27.57 180 top
R1  22.22,46.62 180 top
R2  35.56,11.69 180 bottom
R3  35.56,5.98 180 bottom
R4  35.56,17.41 0 bottom
R5  35.56,15.5 0 bottom
R6  35.56,13.6 0 bottom
R7  35.56,9.79 0 bottom
R8  34.92,20.58 90 bottom
R9  29.21,20.58 270 bottom
R10  28.57,8.52 90 bottom
R11  10.16,39 90 top
R12  22.22,9.15 270 top
R15  10.79,33.92 270 top
R16  20.95,33.92 90 top
R17  25.15,33.92 270 top
R18  10.79,29.47 270 top
R19  6.35,29.47 90 top
R20  15.87,30.11 0 top
R21  15.87,25.66 180 top
R22  12.06,39 90 top
R23  6.35,33.92 90 top
R29  4.44,28.2 0 bottom
R32  8.89,18.04 90 top
R33  16.51,18.04 90 top
R34  41.27,39.63 270 top
R36  19.05,41.54 180 bottom
R37  32.38,8.52 90 bottom
R39  4.44,30.11 180 bottom
RT1  37.46,20.58 270 bottom
S1  12.7,18.04 90 top
TP1  33.66,23.76 0 top
TP2  31.11,13.6 0 bottom
TP3  43.18,12.33 0 top
TP4  25.4,4.71 0 top
TP5  43.81,20.58 0 top
TP6  7.62,37.09 0 top
TP7  28.57,13.6 0 bottom
TP8  31.11,2.8 0 top
TP9  44.96,15.5 0 bottom
TP10  9.52,26.93 0 top
TP11  37.46,24.39 0 top
TP12  8.89,35.82 0 top
TP13  8.89,31.38 0 top
TP14  13.97,28.84 0 top
TP15  20.67,31.67 0 top
TP16  3.17,31.38 0 top
TP17  24.89,35.06 0 bottom
U1  24.74,15.02 180 bottom
U3  15.75,34.04 90 top
Y2  39.37,21.85 0 top
Y3  45.08,30.74 90 top

### Tracks (layer width: path | path; a pad name or v marks a point on that pad's centre or on a via)
1.8V  (via drill 0.35)
  Top 0.203: Q8.1 16.72,29.02 R20.2 v18.41,30.11 18.63,30.11 19.05,30.53 19.05,31.5 19.05,33.28 18.89,33.44 U3.8 | R11.2 10.27,39.74 12.17,39.74 | R18.2 11.85,28.62 v13.33,30.11 | U3.13 16.75,38.1 16.7,38.15
  Top 0.254: R16.2 21.8,34.77 | 21.8,34.77 22.04,34.77 Q4.1 | 12.17,39.74 R22.2 13.76,38.15 C21.1 C22.1 16.7,38.15 v18.39,36.46 | Q1.1 10.44,33.42 R15.2 12.06,31.8 v12.06,31.35 | v22.86,35.82 21.8,34.77 | Q6.1 10.44,28.97 R18.2 10.79,28.2 TP10.TP | v18.41,31.53 19.03,31.53 19.05,31.5
  Bottom 0.203: v18.41,31.53 18.23,31.53 16.84,32.92 16.84,35.09 19.58,37.83 | v13.33,30.11 v18.41,30.11
  Bottom 0.254: IC5.2 21.05,39.31 C41.1 19.58,37.83 | 19.58,37.83 18.41,36.67 18.41,36.46 v18.39,36.46 | 19.58,37.83 19.58,35.93 20.95,34.55 22.22,35.82 v22.86,35.82 | v12.06,31.35 13.31,30.11 v13.33,30.11
!CS
  Top 0.203: R15.1 11.21,34.77 12.14,33.84 U3.22
  Top 0.254: Q1.2 9.7,34.77 9.94,34.77 | 9.94,34.77 R15.1 | TP12.TP 9.94,34.77
!CS!_VIN
  Top 0.254: JP10.2 20.47,27.59 20.47,29.19 23.29,32.01 26.03,32.01 26.03,39 24.13,40.9 9.52,40.9 5.24,36.62 5.24,33.75 5.93,33.07 R23.1 7.2,33.92 Q1.3
AC1  (via drill 0.35)
  Top 0.254: v24.13,23.12 23.45,23.12 21.9,21.57 20.01,21.57 19.73,21.85 v17.78,21.85
  Bottom 0.254: C7.1 C8.1 13.12,14.23 C9.2 C10.2 C12.2 | C7.1 18.21,15.72 | 18.21,15.72 C3.1 | 18.21,15.72 19.26,15.72 20.16,16.62 20.16,16.87 20.83,17.53 22.35,17.53 22.99,16.89 U1.2 | C1.1 C2.1 24.13,22.07 v24.13,23.12 | v17.78,21.85 16.51,20.58 C7.1
  pour Bottom: 11.43,21.85 11.43,12.96 12.06,12.96 13.97,14.87 19.05,14.87 19.05,16.77 17.78,16.77 17.78,21.85
AC2
  Bottom 0.254: C6.1 C5.1 24.13,7.03 24.13,3.44 16.59,3.44 COIL.1 15.87,9.32 15.87,12.75 C8.2 C7.2 18.21,14.02 C4.1 18.83,13.81 20.7,11.94 21.67,11.94 U1.19
  pour Bottom: 11.75,12.01 13.97,14.23 19.05,14.23 19.05,12.96 17.78,12.96 17.78,-0.37 14.6,-0.37 8.89,5.34 12.7,9.15 12.7,11.06
AC11
  Bottom 0.254: C10.1 C12.1 | COIL.2 10.49,13.68 C9.1 C10.1 | C11.1 C10.1
  pour Bottom: 8.25,5.34 12.06,9.15 12.06,11.06 10.79,12.33 10.79,12.96 10.79,21.22 8.89,21.22 0.63,12.96 0.63,11.06 6.35,5.34
AD0/SDO
  Top 0.203: U3.9 19.12,33.84 19.79,33.17
  Top 0.254: Q4.2 21.3,33.42 21.06,33.17 | 21.06,33.17 R16.1 20.95,33.06 20.95,31.95 TP15.TP | 19.79,33.17 21.06,33.17
AD0/SDO_VIN
  Top 0.254: 24.13,33.92 24.3,33.92 R17.1 22.59,37.32 JP2.2 | 24.13,33.92 Q4.3 | JP9.2 19.68,25.03 19.68,29.47 24.13,33.92
ADC  (via drill 0.35)
  Top 0.254: v3.96,32.5 3.17,31.72 TP16.TP | IC2.24 36.61,33.7 v36.83,33.92
  Bottom 0.254: R29.2 R39.1 3.59,31.8 3.81,32.01 | 3.81,32.01 13.33,32.01 14.6,30.74 18.12,30.74 18.14,30.76 22.54,30.76 26.37,26.93 30.8,26.93 32.02,28.16 35.52,28.16 36.83,29.47 v36.83,33.92 36.2,33.28 C42.1 | 3.81,32.01 3.96,32.16 v3.96,32.5
AUX_CL  (via drill 0.35)
  Top 0.203: v15.93,31.53 17.55,31.53 17.78,31.76 17.78,31.79 18.15,32.16 18.18,32.16 18.54,32.52 18.54,32.77 18.27,33.04 U3.7
  Top 0.254: R11.1 10.79,37.51 v10.79,36.46
  Bottom 0.203: v15.93,31.53 11,36.46 v10.79,36.46
AUX_DA
  Top 0.203: U3.21 13.01,34.24 12.06,35.19 R22.1
AVDD
  Top 0.254: C31.1 40.22,30.32 39.62,29.72 IC2.19 35.31,29.72 34.92,30.11 34.92,31.38 35.27,31.72 IC2.23 37.81,31.72 38.1,32.01 38.1,38.15 C24.1 C30.1 R34.2
BLE_CONNECTED  (via drill 0.35)
  Top 0.254: IC1.11 40.25,14.5 v44.43,18.68 | IC2.15 38.58,27.72 39.35,26.95 39.35,26.66 39.73,26.27 40.03,26.27 v42.55,23.76
  Bottom 0.254: v42.55,23.76 44.43,21.87 v44.43,18.68 44.96,18.14 TP9.TP
BLE_OP_MODE
  Top 0.254: IC1.8 36.46,10.89 38.38,10.89 45.08,17.59 45.08,20.58 | 45.08,20.58 45.08,22.49 42.55,22.49 38.31,26.72 IC2.13 | TP5.TP 45.08,20.58
BLE_RESET
  Top 0.254: IC1.5 32.2,7.06 30.48,5.34 27.3,5.34 26.03,6.61 | IC2.40 31.11,30.72 31.11,28.2 27.08,24.16 27.08,14.78 26.03,13.74 26.03,6.61 | 26.03,6.61 26.03,5.34 TP4.TP
BLE_RX  (via drill 0.35)
  Top 0.254: IC2.6 32.13,23.37 33.39,22.11 IC1.13 33.39,16.21 32.71,15.52 32.41,15.52 v31.75,14.87
  Bottom 0.254: TP2.TP 31.75,14.23 v31.75,14.87
BLE_TX
  Top 0.254: IC2.7 32.63,23.76 | 32.63,23.76 32.63,23.45 34.59,21.49 IC1.12 | 32.63,23.76 TP1.TP
BLE_VDD
  Top 0.254: IC1.7 35.33,9.79 38.38,9.79 42.05,13.46 | 42.05,13.46 45.72,17.13 45.72,24.39 43.81,24.39 39.48,28.72 IC2.17 | TP3.TP 42.05,13.46
BOOT1
  Bottom 0.254: C3.2 18.83,18.04 22.86,18.04 23.51,17.39 23.51,16.79 U1.3
BOOT2
  Bottom 0.254: C4.2 18.41,10.18 18.27,10.03 18.27,4.21 18.41,4.07 23.49,4.07 23.49,6.86 23.64,7 23.64,10.56 24.01,10.94 23.99,10.97 U1.17
CHG  (via drill 0.35)
  Top 0.254: v26.03,18.04 23.49,18.04 22.22,16.77 22.22,12.11 CHG.C
  Bottom 0.254: U1.7 25.49,17.5 v26.03,18.04
CLAMP1
  Bottom 0.254: C2.2 24.76,19.31 24.49,19.04 U1.5
CLAMP2
  Bottom 0.254: C5.2 24.76,9.79 24.49,10.06 U1.16
COMM1
  Bottom 0.254: C1.2 26.56,19.84 24.99,18.27 U1.6
COMM2
  Bottom 0.254: U1.15 24.99,11.05 C6.2
DBG_!RESET  (via drill 0.35)
  Top 0.254: 8.89,16.77 8.89,16.35 C33.1 3.17,19.1 3.17,20.58 4.15,20.58 4.17,20.6 4.72,20.6 4.74,20.58 5.08,20.58 5.71,21.22 5.71,27.81 5.57,27.95 5.57,29.29 5.73,29.45 7.02,29.45 7.17,29.6 7.17,32.24 5.73,32.24 4.84,33.13 4.84,36.79 9.36,41.31 25.15,41.31 25.15,47 v26.67,48.52 | 8.89,16.77 R32.1 9.84,17.09 10.79,18.04 10.79,19.46 S1.2 | S1.1 10.64,16.77 8.89,16.77 | IC2.16 36.63,28.2 38.73,28.2 v40,26.93 | v37.46,44.71 34.39,44.71 v34.29,44.81
  Bottom 0.254: v40,26.93 37.46,29.47 37.46,33.62 37.49,33.64 37.49,34.19 37.1,34.57 35.54,34.57 34.92,35.19 34.92,37.73 39.37,42.17 39.37,43.44 38.1,44.71 v37.46,44.71 | 27.33,48.55 27.33,47.31 29.83,44.81 v34.29,44.81 | v26.67,48.52 26.69,48.55 27.33,48.55 | 27.33,48.55 27.96,49.18 29.58,49.18 DEBUG.8
DBG_SWCLK  (via drill 0.35)
  Top 0.254: v30.48,45.98 28.16,43.66 28.16,42.59 28.57,42.17 28.57,41.2 28.55,41.17 28.55,40.63 29.84,39.34 29.84,35.44 28.6,34.19 28.6,33.36 28.16,32.93 IC2.37
  Bottom 0.254: v30.48,45.98 31.59,47.09 DEBUG.7
DBG_SWDIO  (via drill 0.35)
  Top 0.254: IC2.38 26.96,31.72 26.96,33.57 v28.57,35.19
  Bottom 0.254: v28.57,35.19 33.02,35.19 33.34,35.5 33.34,41.22 35.56,43.44 35.56,45.68 DEBUG.5
DBPRINT_RX  (via drill 0.35)
  Top 0.254: DEBUG.3 33.25,47.48 33.94,48.17 34.55,48.17 35.67,47.05 36.64,47.05 40.12,43.56 41.75,43.56 43.99,41.32 43.99,38.76 48.26,34.49 v48.26,26.17 | v28.19,23.88 28.96,23.88 29.63,24.56 IC2.1
  Bottom 0.254: v48.26,26.17 44.31,26.17 42.74,24.6 28.91,24.6 v28.19,23.88
DBPRINT_TX  (via drill 0.35)
  Top 0.254: DEBUG.2 31.72,49.06 31.24,49.54 29.21,49.54 28.36,48.69 v28.36,44.72 | v27.15,45.47 27.15,36.3 26.55,35.7 26.55,31.55 26.88,31.22 IC2.39
  Bottom 0.254: v28.36,44.72 27.9,44.72 v27.15,45.47
DECOUPLE
  Top 0.254: IC2.29 33.13,35.71 31.33,37.51 C32.1
EN2  (via drill 0.35)
  Top 0.254: v29.84,13.6 30.48,12.96 32.38,12.96 34.95,15.52 35.11,15.52 35.27,15.68 35.27,18.39 v36.2,19.31
  Bottom 0.254: v29.84,13.6 29.32,14.12 29.09,14.12 TP7.TP 27.9,14.27 U1.11 | v36.2,19.31 35.7,19.8 35.7,22.1 34.68,23.12 28.57,23.12 28.57,22.24 28.43,22.1 28.43,20.51 R9.2
FOD  (via drill 0.35)
  Top 0.254: v31.25,10.4 31.88,11.03 v33.02,11.03
  Bottom 0.254: R4.1 37.46,16.35 37.46,5.29 36.88,4.71 35.71,4.71 35.33,4.32 33.13,4.32 32.36,5.09 32.36,5.64 32.75,6.02 33.29,6.02 33.34,5.98 R3.1 C16.1 R7.2 33.46,11.03 v33.02,11.03 | v31.25,10.4 27.45,10.4 25.49,12.36 U1.14
GND  (via drill 0.35)
  Top 0.203: U3.20 13.88,34.64 13.33,35.19 | U3.18 14.75,36.22 14.99,36.46
  Top 0.254: 28.59,12.33 IC1.17 | C29.2 C32.2 | C33.2 9.42,14.55 13.97,14.55 R33.1 20.02,13.58 | C28.2 24.86,28.72 IC2.44 30.11,28.72 v30.21,28.81 | C21.2 15.24,39.85 | 15.24,39.85 C22.2 C23.2 20.13,38.13 JP2.1 | C31.2 41.31,29.22 IC2.18 34.67,29.22 34.61,29.15 | C31.2 C37.2 | C37.2 44.23,28.39 Y3.4 42.03,28.74 C31.2 | C32.2 31.11,44.07 33.41,44.16 36.75,44.16 37.46,43.44 | 37.46,43.44 C24.2 C30.2 40,41.12 40,42.17 42.56,42.17 43.59,41.15 43.59,38.59 45.08,37.09 | v33.02,5.36 31.16,5.36 30.48,4.68 v28.57,4.68 | 20.02,13.58 20.02,6.27 v20.95,5.34 23.49,2.8 v28.57,2.8 | C32.2 30.9,39.21 v29.21,40.9 | v27.94,18.04 28.59,17.39 IC1.17 | IC1.17 28.59,17.85 C25.2 C26.2 31.63,22.79 IC2.5 31.63,26.6 v32.35,27.31 | 28.59,12.33 30.82,12.33 30.84,12.3 32.5,12.3 35.38,15.18 36.09,15.18 C34.2 C35.2 42.33,17.83 v42.55,18.04 | v4.44,26.93 1.33,26.93 | BATT.1 1.33,24.97 1.33,26.93 | 45.08,37.09 45.94,36.24 C36.2 46.28,34.84 Y3.2 47.62,31.4 47.62,25.66 | C27.2 42.55,34.55 43.41,35.41 43.41,35.8 43.57,35.96 43.96,35.96 45.08,37.09 | 13.33,35.19 13.33,35.82 13.97,36.46 14.99,36.46 v15.24,36.46 | v7.64,25.68 7.64,24.07 v6.84,23.27 | 47.62,25.66 46.74,25.66 46.6,25.52 45.01,25.52 C37.2 | v34.29,27.5 34.29,28.84 34.61,29.15 | 37.46,43.44 37.46,43.78 38.12,44.44 38.12,44.98 36.47,46.64 34.56,46.64 DEBUG.4 | v28.57,6 28.59,6.02 IC1.2 28.59,9.77 27.3,11.06 27.3,11.69 27.94,12.33 28.59,12.33 | v33.66,30.11 34.61,29.15 | v15.4,39.15 15.24,39.31 15.24,39.85 | 1.33,26.93 1.35,26.93 2.4,27.97 2.4,31.87 4.43,33.9 4.43,36.96 9.19,41.71 18.81,41.71 PWR_LED.C 21.97,44.08 v22.1,43.95 | 47.62,25.66 47.62,22.83 47.8,22.66 47.8,20.75 v46.99,19.95
  Top 0.254: v20.83,14.99 20.83,14.38 20.02,13.58
  Bottom 0.254: C18.2 C17.2 18.65,25.64 18.14,25.64 18.1,25.68 v7.64,25.68 | C20.2 R10.1 v28.57,6 v28.57,4.68 v28.57,2.8 | C16.2 R3.2 35.16,4.73 33.66,4.73 v33.02,5.36 | C19.2 32.42,19.73 D1.A | PS1.3 20.1,45.35 | 20.1,45.35 PS1.4 | PS1.9 PS1.8 18.75,45.35 | PS1.13 20.1,45.35 | PS1.11 18.07,46.02 18.47,46.02 18.63,45.86 18.63,45.47 18.75,45.35 | 18.75,45.35 PS1.13 | IC5.1 22.98,37.51 25.57,40.1 | C38.2 26.88,37.09 23.4,37.09 IC5.1 | IC5.1 21.05,37.41 C41.2 | C40.2 22.86,45.35 | 22.86,45.35 22.86,43.69 | 22.86,43.69 C39.2 | 20.1,45.35 22.86,45.35 | C14.2 v20.95,5.34 20.95,5.76 C13.2 | v29.21,40.9 26.37,40.9 25.57,40.1 | D1.A 33.02,17.19 R5.2 | D1.A 32.84,19.13 31.75,18.04 v27.94,18.04 27.76,18.04 U1.9 26.42,16.7 26.42,16.32 26.16,16.06 26.16,15.75 25.92,15.52 U1.31 | RT1.1 39.45,21.13 v42.55,18.04 | 3.81,21.85 BATT.1 6.05,22.49 v6.84,23.27 | R29.1 4.44,27.35 v4.44,26.93 | v32.35,27.31 34.1,27.31 v34.29,27.5 | v15.24,36.46 15.4,36.61 v15.4,39.15 19.05,39.15 | 19.05,39.15 19.45,39.15 20.4,40.1 25.57,40.1 | v30.21,28.81 31.5,30.11 32.72,30.11 32.75,30.13 33.63,30.13 v33.66,30.11 33.19,30.57 C42.2 | 46.35,20.58 46.55,20.39 v46.99,19.95 | U1.26 22.49,15.54 U1.1 22.65,15.61 U1.27 | U1.20 23.16,14.94 | 23.16,14.94 U1.33 | U1.26 U1.21 | U1.26 23.08,14.94 23.16,14.94 | U1.26 23.25,15.01 U1.28 | U1.24 U1.22 26.73,14.74 U1.23 | U1.21 U1.29 | U1.21 U1.32 | v20.83,14.99 22.49,14.99 22.65,14.83 U1.25 | PS1.13 19.05,39.15 | v22.1,43.95 22.61,43.95 22.86,43.69
  Bottom 0.61: C13.2 C15.2
  Bottom 0.813: U1.1 22.49,14.99 U1.20 | 25.24,15.02 U1.30 | 25.24,15.02 U1.21 27.15,15.02 27.11,14.98 26.59,14.98 26.56,15.01 U1.23 | 25.24,15.02 U1.31
  pour Bottom: 18.41,-1.01 18.41,12.33 19.68,12.33 19.68,17.41 18.41,18.68 18.41,22.49 10.79,22.49 10.79,21.85 8.89,21.85 1.27,14.23 0.63,14.23 -0.64,15.5 -0.64,18.68 -1.27,19.31 -1.27,23.12 -1.27,25.03 -1.27,30.11 -0.64,30.74 -0.64,33.92 0,34.55 0,36.46 1.27,37.73 1.27,40.27 3.81,42.81 6.35,45.35 8.89,47.89 10.79,49.79 12.7,49.79 14.6,51.7 15.87,51.7 16.51,52.33 19.05,52.33 23.49,52.33 27.3,52.33 31.11,52.33 34.92,52.33 35.56,51.7 39.37,51.7 40.64,50.43 42.55,50.43 43.81,49.16 46.35,46.62 48.26,44.71 48.26,42.81 49.53,41.54 49.53,40.27 50.8,39 50.8,37.73 52.07,36.46 52.07,32.01 52.07,30.11 52.07,26.93 52.07,24.39 52.07,21.85 52.07,19.31 51.44,18.68 51.44,16.77 50.8,16.14 50.8,11.69 50.16,11.06 50.16,10.42 48.26,8.52 48.26,7.88 45.72,5.34 43.18,2.8 42.55,2.8 40.64,0.9 38.73,0.9 38.1,0.26 35.56,0.26 34.29,-1.01 30.48,-1.01 29.21,-2.28 26.67,-2.28 22.22,-2.28 20.32,-2.28 19.05,-1.01
  pour Top: -9.53,57.41 -9.53,3.44 6.35,-12.44 46.99,-12.44 63.5,4.07 63.5,58.68 -8.26,58.68
ILIM
  Bottom 0.254: R2.1 27.3,11.69 26.49,12.51 U1.12
IMU_VDD  (via drill 0.35)
  Top 0.254: IC2.41 26.64,30.22 25.5,31.35 v24.78,31.35
  Bottom 0.254: IC5.3 26.03,39.21 C38.1 27.72,39.63 28.57,39.63 28.57,37.09 26.05,34.57 26.05,33.9 TP17.TP 24.78,34.95 v24.78,31.35
INT  (via drill 0.35)
  Top 0.203: U3.12 18.66,35.04 v18.74,34.96
  Top 0.254: IC2.8 33.13,26.93 | 33.13,26.93 33.13,28.32 33.02,28.43 v33.02,28.84 | 33.13,26.93 33.93,26.93 34.02,26.84 34.56,26.84 34.65,26.93 34.92,26.93 TP11.TP
  Bottom 0.254: v33.02,28.84 31.75,28.84 30.43,27.52 26.41,27.52 22.56,31.38 22.5,31.38 21.46,32.42 21.28,32.42 v18.74,34.96
LED  (via drill 0.35)
  Top 0.254: IC2.32 31.63,35.95 v31.66,35.97 | v29.19,36.2 29.19,39.42 27.75,40.85 27.75,48.37 26.94,49.18 26.4,49.18 26.01,48.79 26.01,48.52 24.11,46.62 R1.1
  Bottom 0.254: v31.66,35.97 31.17,36.46 29.44,36.46 v29.19,36.2
N$1
  Top 0.254: IC2.27 34.13,35.67 34.43,35.96 34.43,40.35 JP1.2
N$2
  Bottom 0.254: R5.1 35.46,14.55 R6.1
N$3
  Top 0.254: R1.2 21.59,46.3 21.59,45.35 22.86,44.08 PWR_LED.A
N$4
  Bottom 0.254: R2.2 R7.1
N$5
  Top 0.254: R12.2 22.42,8.1 CHG.A
N$6
  Bottom 0.254: R9.1 C19.1 32.42,21.43 D1.C 34.32,22.03 R8.2
N$7
  Top 0.254: JP4.2 35.56,36.46 34.63,35.53 IC2.26
N$8
  Top 0.254: IC2.47 26.96,27.22 26.67,26.93 26.67,23.12 23.49,19.95 JP6.1
N$9
  Top 0.254: C35.1 40.62,19.55 Y2.2 40.64,21.87 40.64,22.49 40,23.12 35.56,23.12 35.13,23.55 IC2.12
N$10
  Top 0.203: U3.10 19.38,34.24 19.68,34.55
  Top 0.254: C23.1 19.68,36.88 19.68,34.55
N$11
  Top 0.254: JP8.1 26.7,27.72 IC2.46
N$12
  Top 0.254: JP9.1 23.43,25.03 26.63,28.22 IC2.45
N$14
  Top 0.254: IC2.11 34.63,22.78 35.56,21.85 Y2.1 38.12,20.14 C34.1
N$15
  Top 0.254: JP10.1 21.46,28.84 23.37,30.74 24.97,30.74 25.92,29.79 28.09,29.79 IC2.42
N$19
  Top 0.254: IC2.20 39.55,30.22 40.47,31.15 43.88,31.15 Y3.1 46.28,26.65 C37.1
N$20
  Top 0.254: IC2.21 36.63,30.74 39.37,30.74 43.81,35.19 C36.1 43.88,34.84 Y3.3
N$22
  Top 0.254: S1.3 S1.4 15.07,18.99 R33.2
N$24
  Top 0.254: R34.1 42.86,40.58 43.18,40.27 43.18,37.09 42.55,36.46 FB1.2
N$25
  Bottom 0.254: RT1.2 41.05,16.45 41.05,8.28 37.06,4.3 35.88,4.3 35.5,3.92 32.96,3.92 32.58,4.3 32.16,4.3 31.75,4.71 31.75,7.03 R37.1
N$28
  Bottom 0.254: PS1.2 21.74,46.1 22.24,46.59 24.42,46.59 L1.2
N$29
  Bottom 0.254: PS1.7 18,41.64 R36.1
RECT  (via drill 0.35)
  Top 0.254: v20.95,11.06 20.55,10.65 20.55,7.71 24.6,3.66 30.48,3.66 | v40,9.15 40,7.84 36.85,4.68 31.5,4.68 30.48,3.66 | 30.48,3.66 30.48,3.44 TP8.TP
  Bottom 0.254: C15.1 22.24,9.98 22.24,11.21 23.51,12.48 23.49,12.51 U1.18 | R4.2 34.71,18.68 | 34.71,18.68 34.71,19.52 R8.1 | 34.71,18.68 35.2,18.18 37.08,18.18 40,15.26 v40,9.15 | v20.95,11.06 C14.1
  Bottom 0.61: C15.1 C14.1 C13.1
SCL/SCLK
  Top 0.203: R18.1 12.7,30.32 12.7,32.43 13.71,33.44 U3.23
  Top 0.254: Q6.2 9.7,30.32 9.94,30.32 | 9.94,30.32 R18.1 | TP13.TP 9.94,30.32
SCL/SCLK_VIN  (via drill 0.35)
  Top 0.254: JP6.2 18.54,19.95 16,22.49 12.06,22.49 8.64,25.91 | 8.64,25.91 6.35,28.2 | 6.35,28.2 R19.1 | Q6.3 7.62,29.47 6.35,28.2 | JP1.1 32.38,43.21 v32.38,43.44 | 8.64,25.91 8.64,24.14 6.12,21.62 6.12,21.05 5.25,20.17 4.67,20.17 v4.44,19.95
  Bottom 0.254: v32.38,43.44 30.62,43.44 25.16,48.9 20.06,48.9 18.82,47.65 16.34,47.65 7.62,38.94 7.62,37.67 3.16,33.2 3.08,33.18 3.04,33.09 2.76,32.81 2.76,32.56 2.15,31.95 2.06,31.62 2.06,28.6 1.99,28.54 1.99,22.07 2.62,21.44 2.95,21.44 v4.44,19.95
SDA/SDI
  Top 0.203: Q8.2 15.02,29.02 15.02,29.47 R20.1 15.02,30.32 13.06,32.29 13.81,33.04 U3.24
  Top 0.254: TP14.TP 14.6,29.47 15.02,29.47
SDA/SDI_VIN  (via drill 0.35)
  Top 0.203: Q8.3 16.48,26.91 16.72,26.67 R21.1
  Top 0.254: JP8.2 19.9,22.49 R21.1 | 16.48,26.91 17.8,26.91 v18.41,26.3 | JP4.1 36.28,43.29 v36.68,43.29 | v38.12,42.81 40.77,42.81 v40.92,42.96
  Bottom 0.254: v40.92,42.96 40.92,32.66 42.57,31.01 42.57,25 40.37,25 39.07,26.3 v18.41,26.3 | v36.68,43.29 37.63,43.29 v38.12,42.81
TERM
  Bottom 0.254: R6.2 34.29,13.6 32.12,15.77 U1.10
TS/CTRL
  Bottom 0.254: R10.2 C20.1 R37.2 32.38,10.42 31.75,11.06 27.36,11.06 25.99,12.43 U1.13
V_BATT  (via drill 0.35)
  Top 0.254: v19.05,19.29 21.82,16.52 21.82,11.52 22.22,11.12 R12.1
  Bottom 0.254: PS1.10 16.12,45.6 | 6.98,25.03 BATT.2 2.54,26.3 2.54,27.89 2.4,28.03 2.4,28.37 2.54,28.51 2.54,31.05 3.38,32.85 8.49,37.96 10.69,37.96 16.12,43.4 16.12,45.6 | 6.98,25.03 15.87,25.03 19.05,21.85 | 19.05,21.85 20.95,19.95 C18.1 C17.1 24.01,18.58 24.01,16.79 U1.4 | C40.1 20.97,47.47 PS1.1 19.74,46.6 19.67,46.67 18.43,46.67 18.35,46.6 PS1.12 17.98,46.62 17.14,46.62 16.12,45.6 | R39.2 6.98,28.42 6.98,25.03 | v19.05,19.29 19.05,21.85
VDD  (via drill 0.35)
  Top 0.254: C29.1 33.63,36.9 IC2.28 33.66,33.68 33.66,31.38 | C25.1 C26.1 31.13,23.99 IC2.4 31.13,27.65 31.52,28.03 31.52,30.51 v32.38,31.38 33.66,31.38 | FB1.1 39.2,34.6 C27.1 39.16,32.65 | IC2.22 38.58,31.22 39.16,31.8 39.16,32.65 | v22.86,28.84 23.28,28.84 C28.1 25.18,29.69 25.65,29.22 IC2.43 29.61,29.22 v30.46,30.06 | v13.97,27.57 15.02,26.51 R21.2 13.33,23.97 v13.33,23.76 | v8.89,23.12 R32.2 | 39.16,32.65 v40,32.65 | R23.2 8.15,36.56 | 8.15,36.56 8.89,37.31 v8.89,39 | R19.2 5.32,31.35 v4.44,31.35 | v36.83,35.82 36.83,34.85 36.17,34.19 36.17,33.26 34.29,31.38 33.66,31.38 | v36.2,45.98 31.75,45.98 30.48,47.25 30.5,47.27 DEBUG.1 | R17.2 24.75,32.67 v24.13,32.67 | v19.68,32.52 19.68,30.09 v19.03,29.43 | 8.15,36.56 TP6.TP
  Bottom 0.254: R36.2 20.15,41.79 22.69,41.79 C39.1 | C39.1 23.8,41.96 25.4,43.56 L1.1 26.85,43.81 27.04,44 | C39.1 22.86,42.17 21.36,43.67 21.36,44.36 21.13,44.6 PS1.5 | v22.86,28.84 19.05,28.84 | 19.05,28.84 15.24,28.84 v13.97,27.57 10.18,31.35 v4.44,31.35 | v13.33,23.76 12.7,23.12 v8.89,23.12 | 27.04,44 27.04,44.34 26.4,44.98 26.4,46.3 24.41,48.3 20.59,48.3 19.47,47.18 17.07,47.18 v8.89,39 | 27.04,44 29.87,41.17 29.87,37.81 27.28,35.22 27.28,33.64 29.14,31.78 31.75,31.78 32.16,31.38 v32.38,31.38 31.77,31.38 v30.46,30.06 | v40,32.65 40,35.82 | 40,35.82 40,43.77 39.52,44.1 37.26,46.37 36.87,45.98 v36.2,45.98 | v36.83,35.82 40,35.82 | v24.13,32.67 22.2,32.67 19.05,35.82 18.85,35.62 18.47,35.62 18.08,35.23 18.08,34.25 19.68,32.65 v19.68,32.52 | v19.03,29.43 19.05,29.41 19.05,28.84

### Text on the board
tNames: VDD | TX | RX | GND | V_BATT | GND | Wireless IMU v1.0 / Jona Cappelle
bNames: !RESET | SWCLK | NC | SWDIO